# EAGLE design Schematic1 (EAGLE 9.5.1)
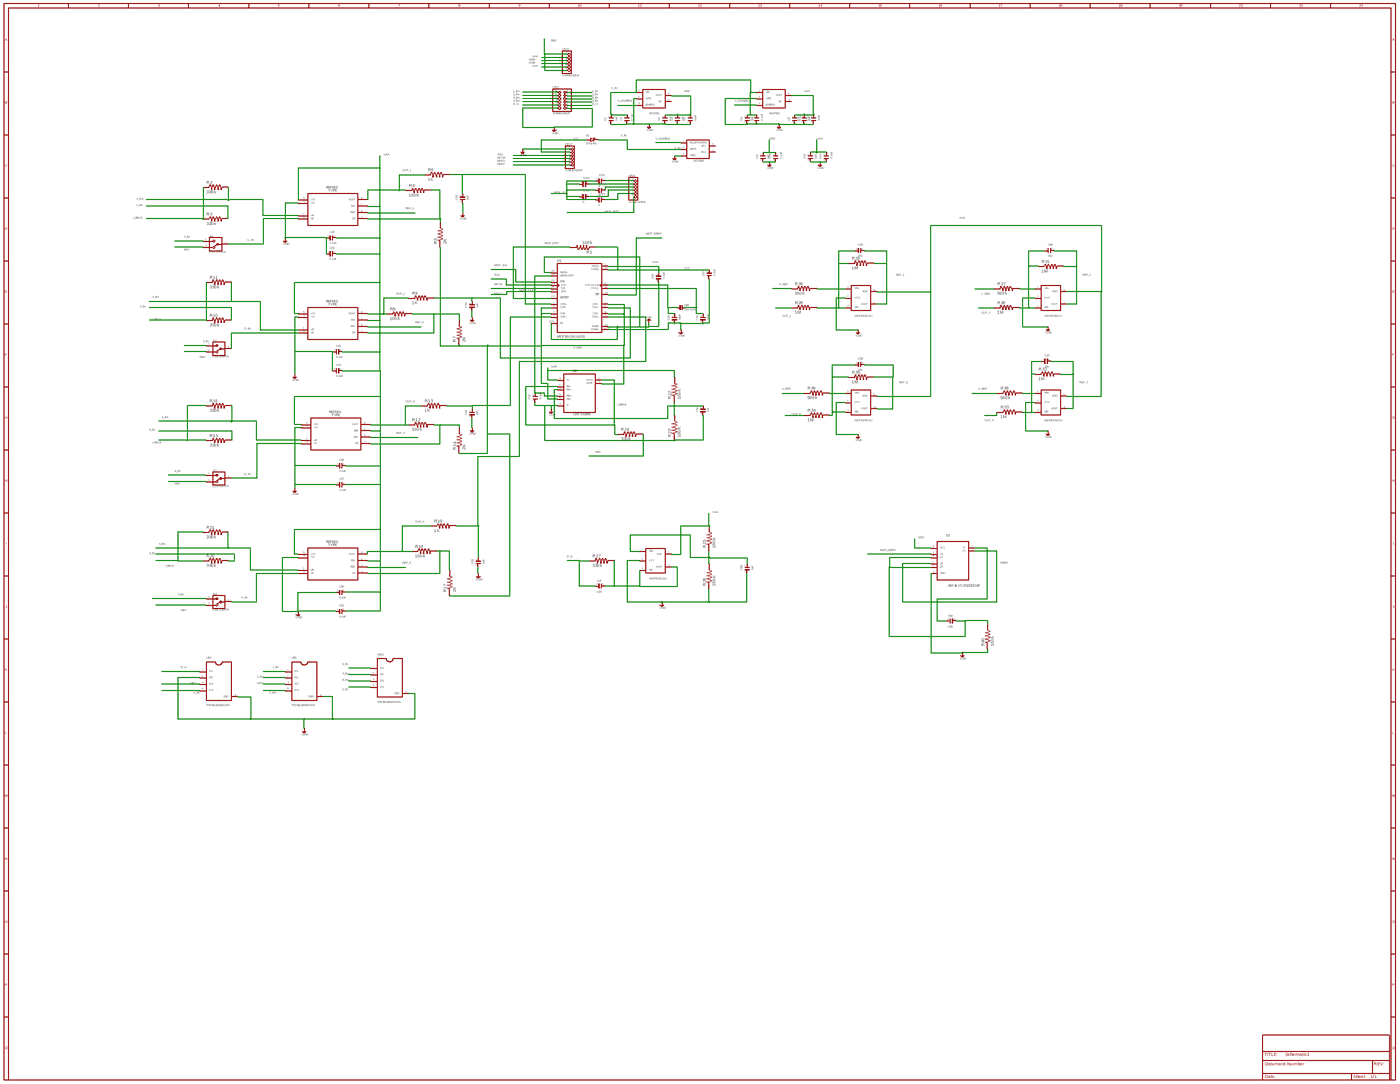
[diagram p0: schematic, sheet 1, overview]
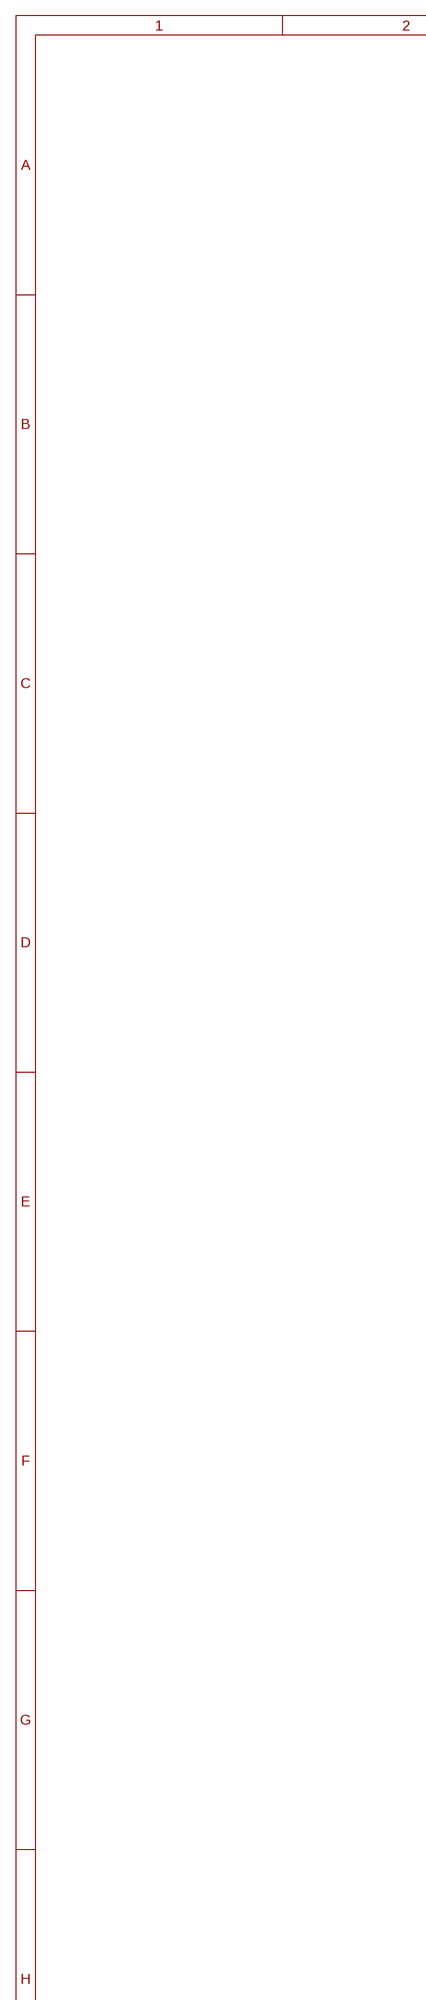
[diagram p1: schematic, sheet 1, part 1 of 8]
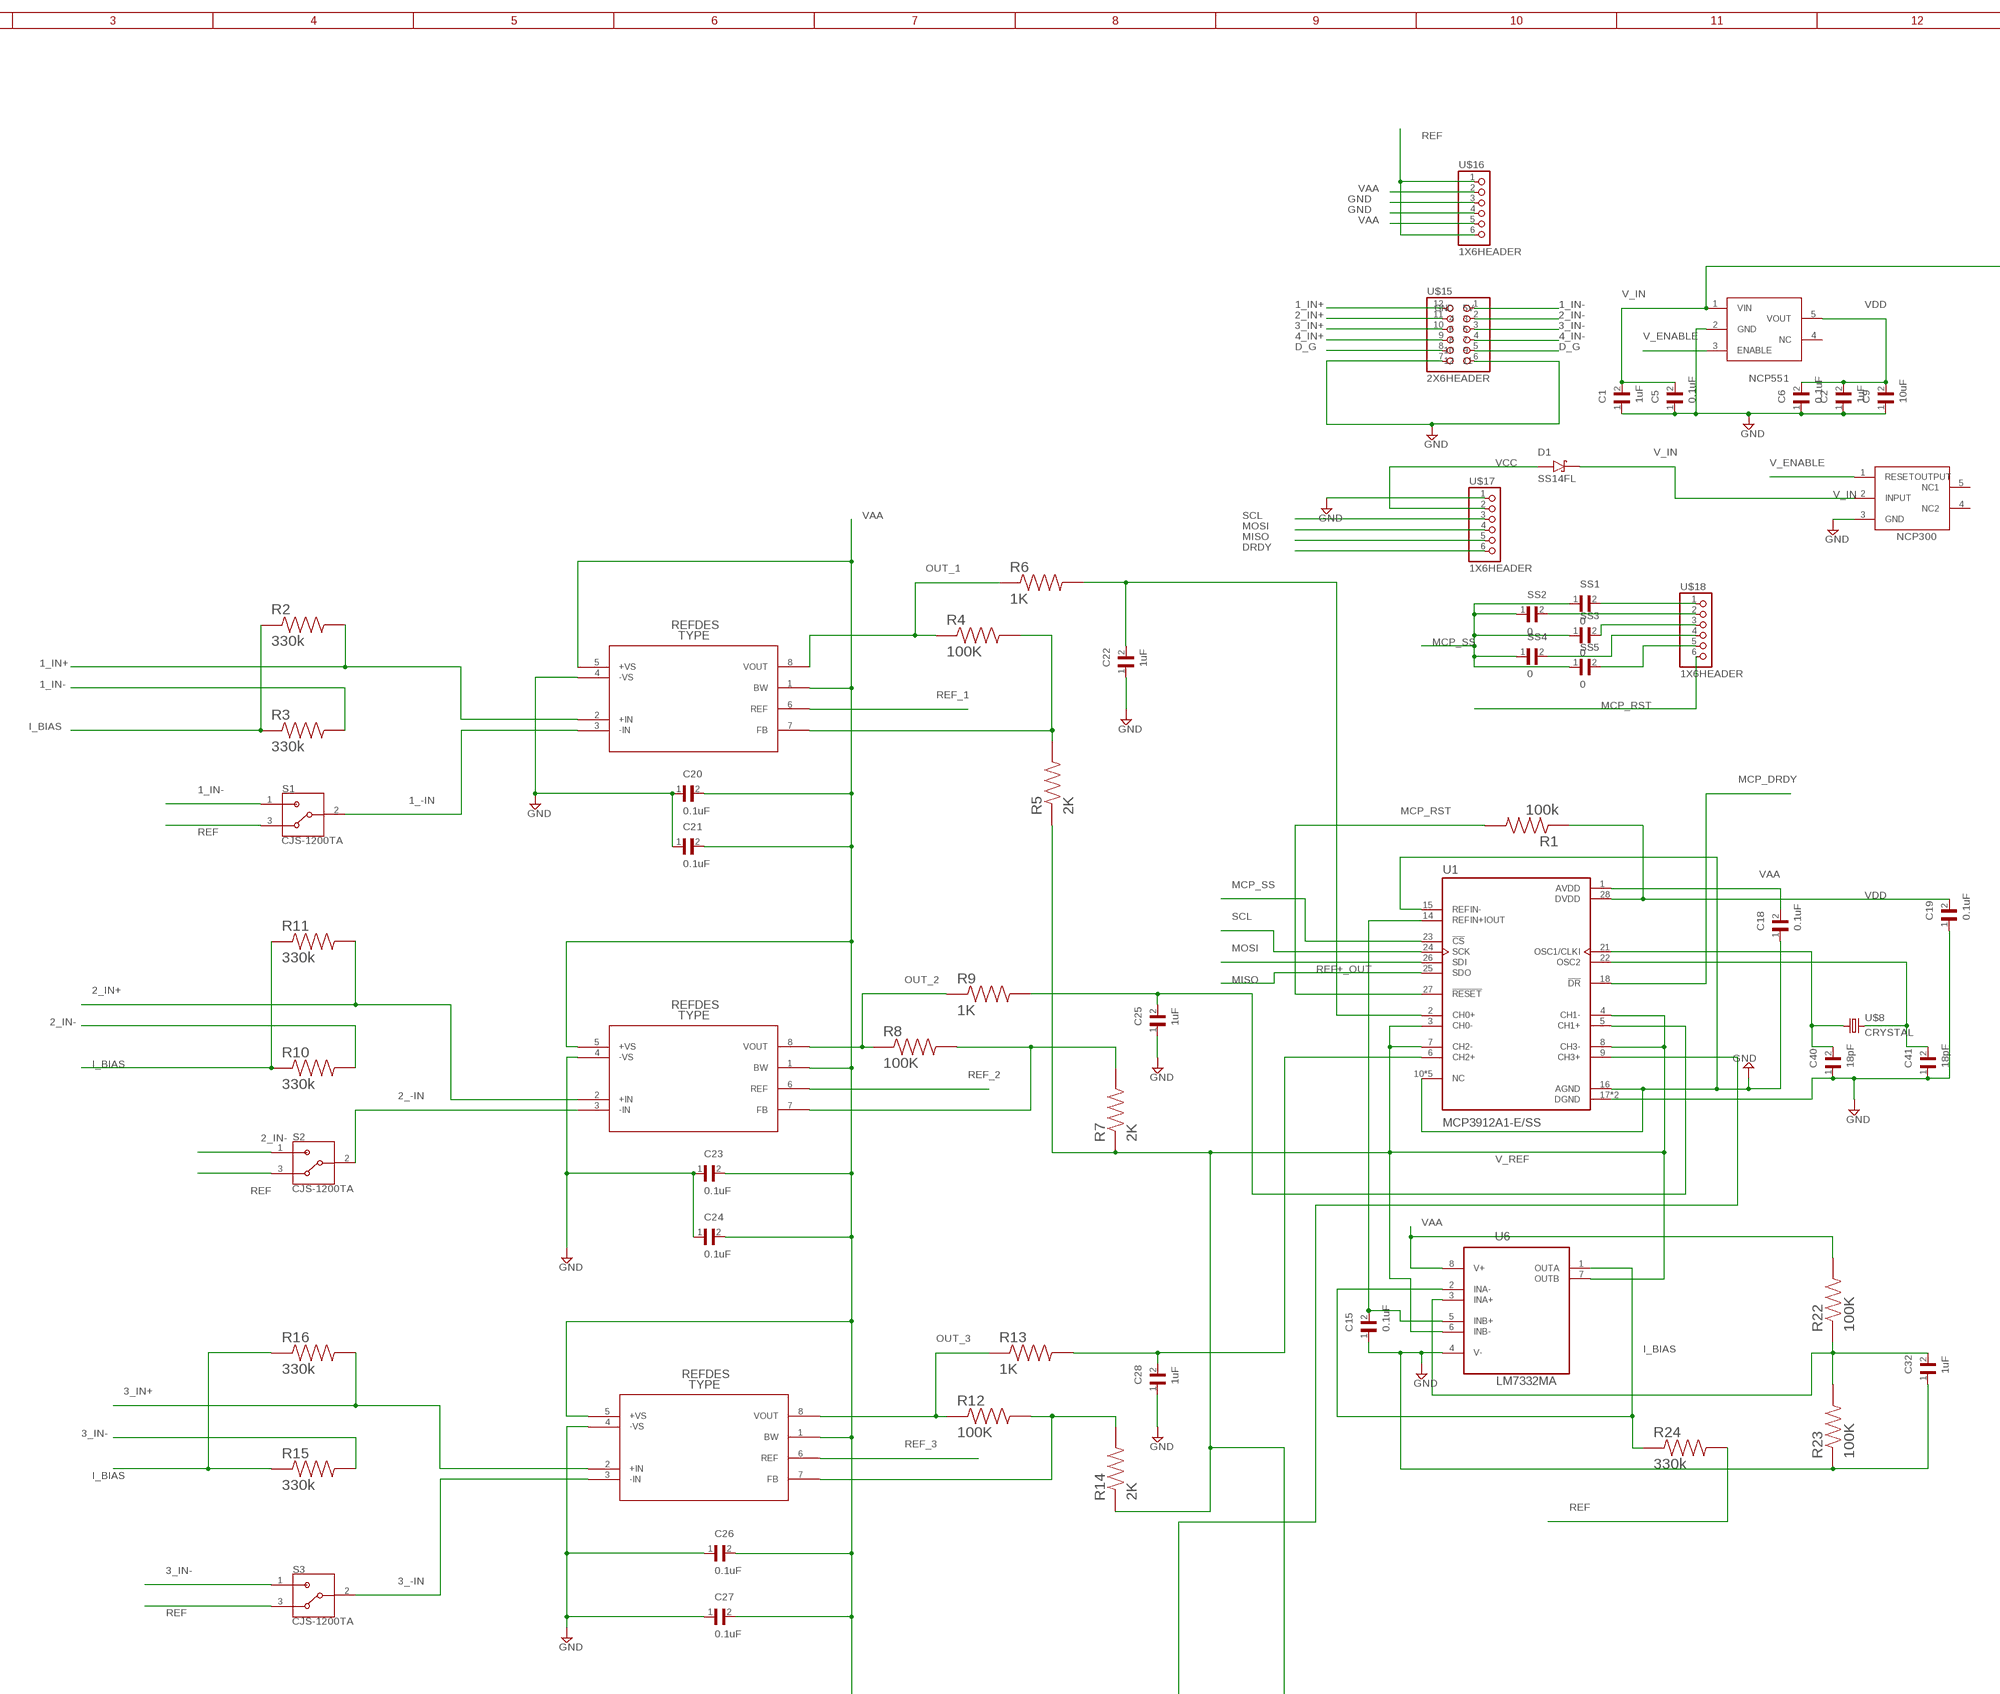
[diagram p2: schematic, sheet 1, part 2 of 8]
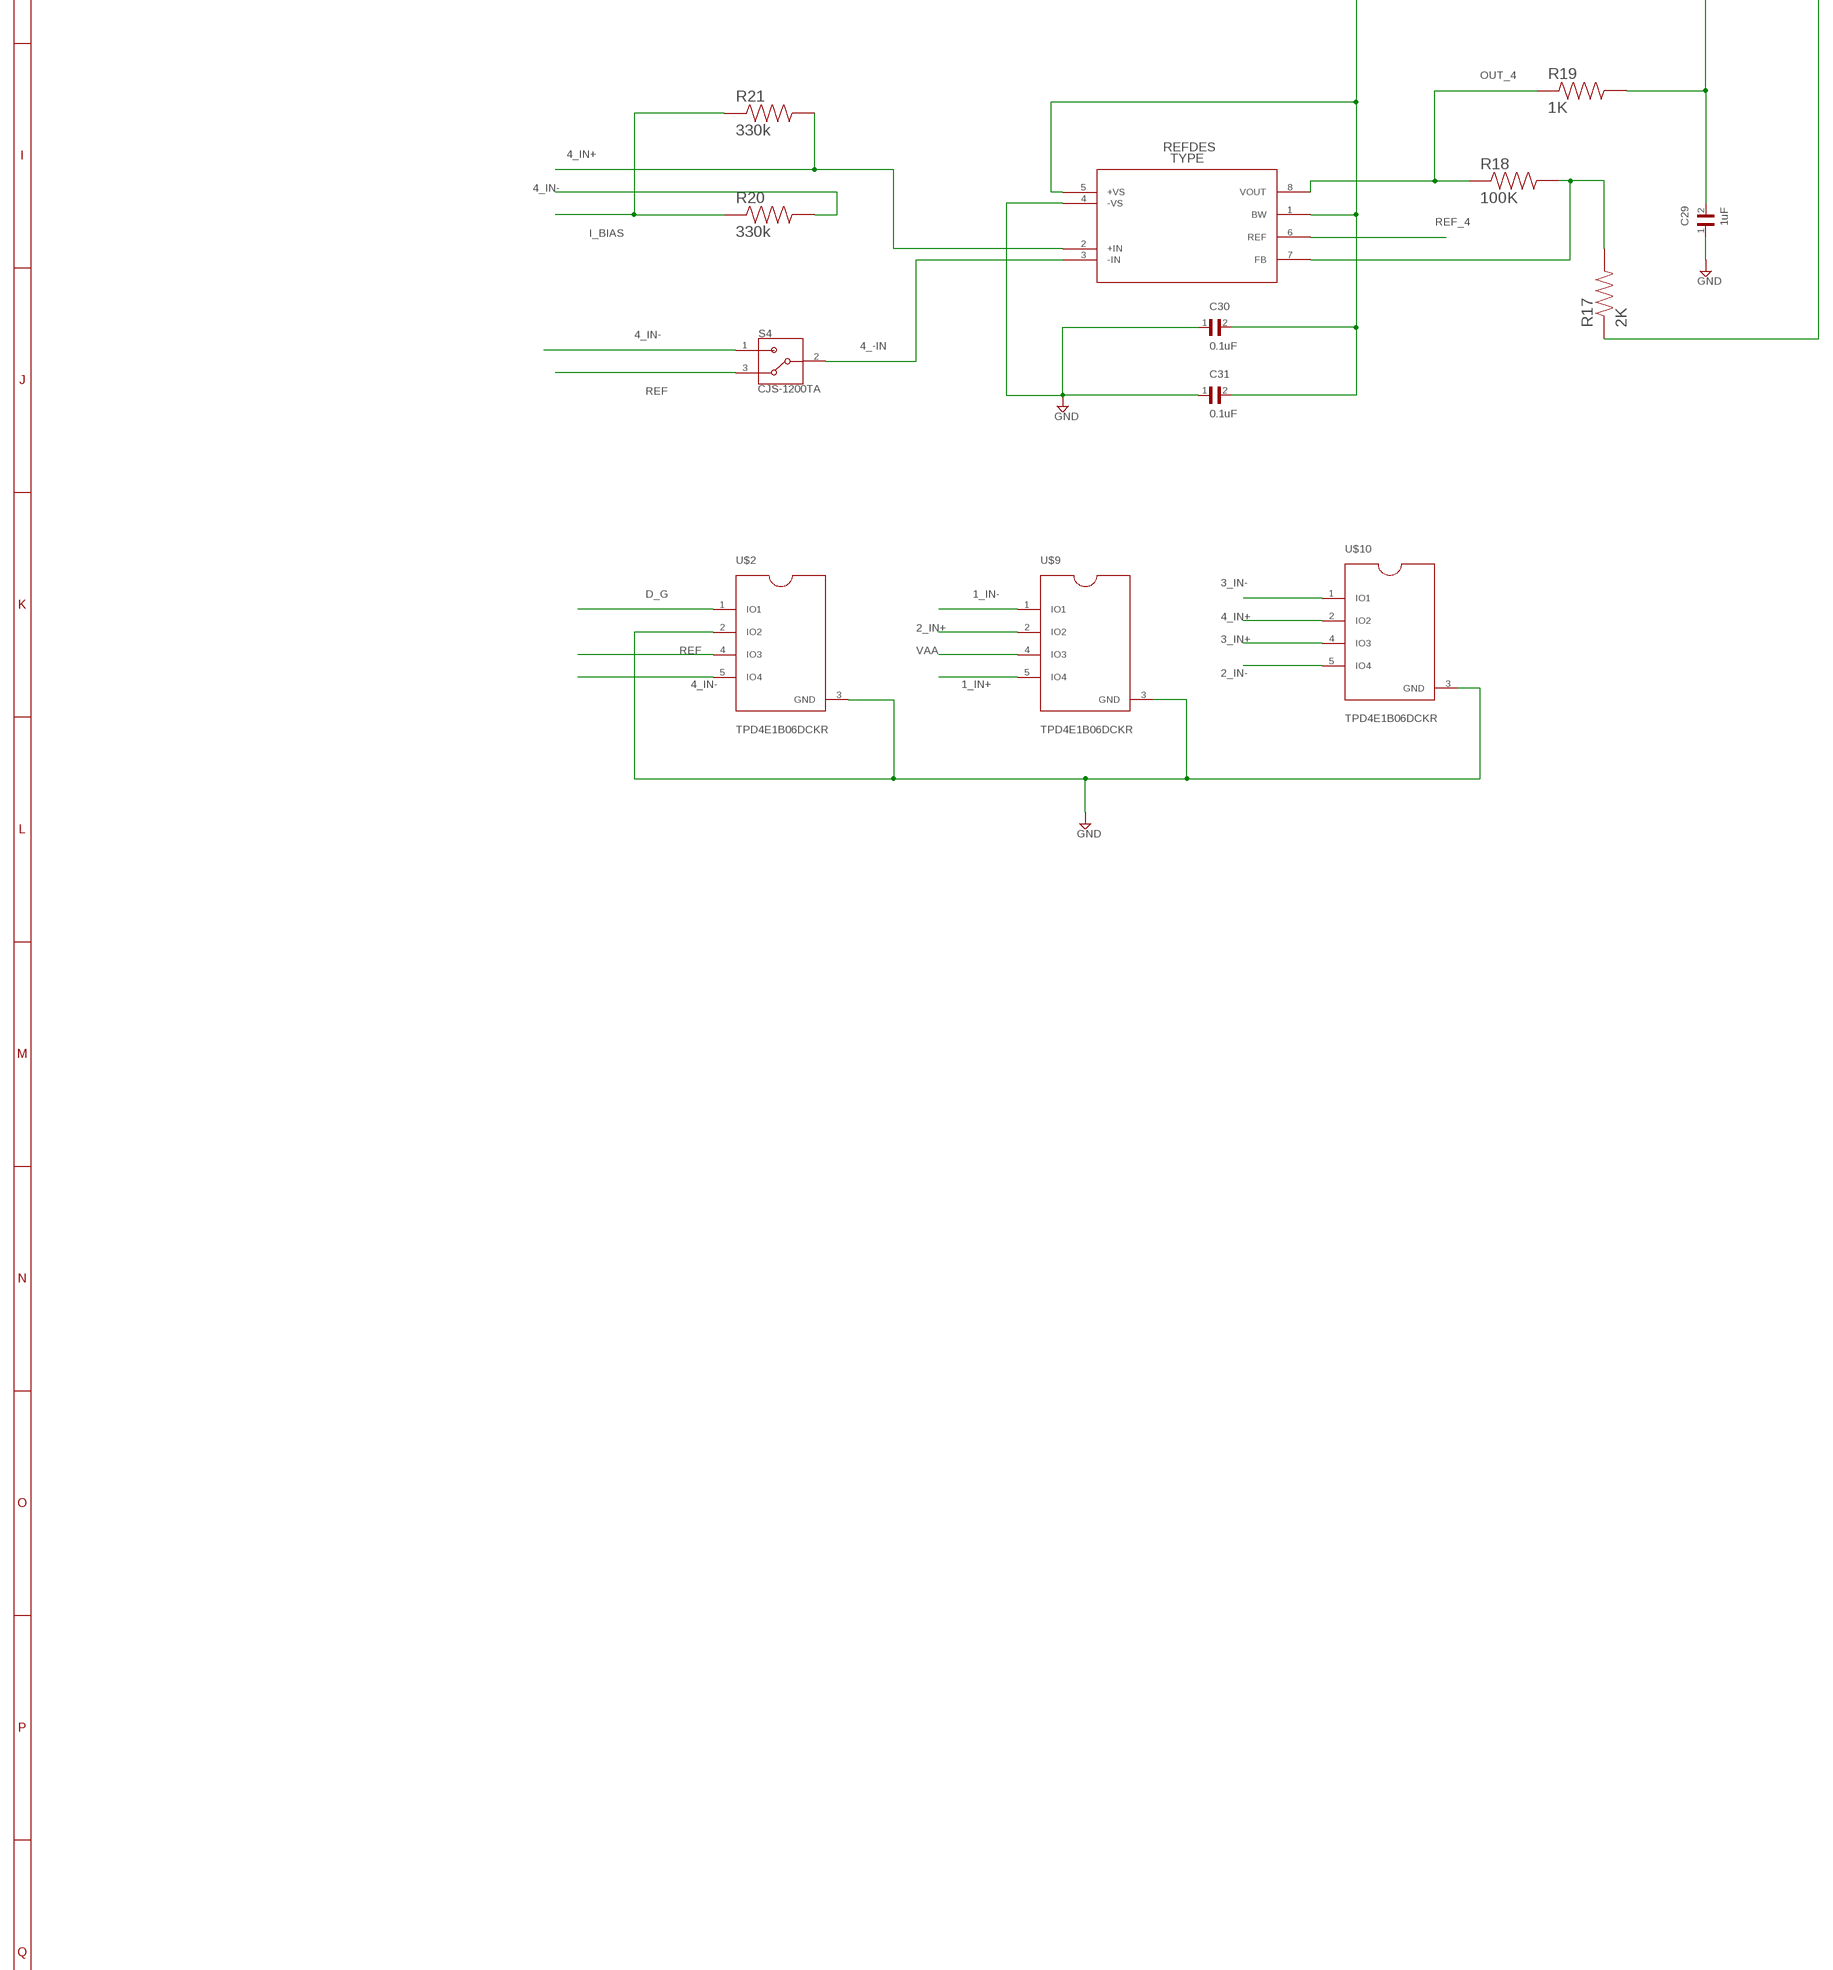
[diagram p3: schematic, sheet 1, part 3 of 8]
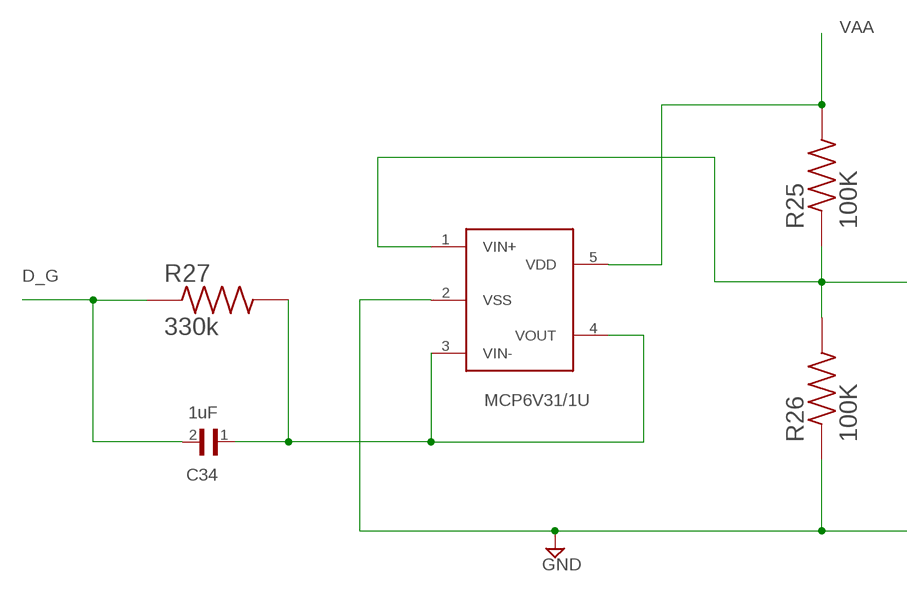
[diagram p4: schematic, sheet 1, part 4 of 8]
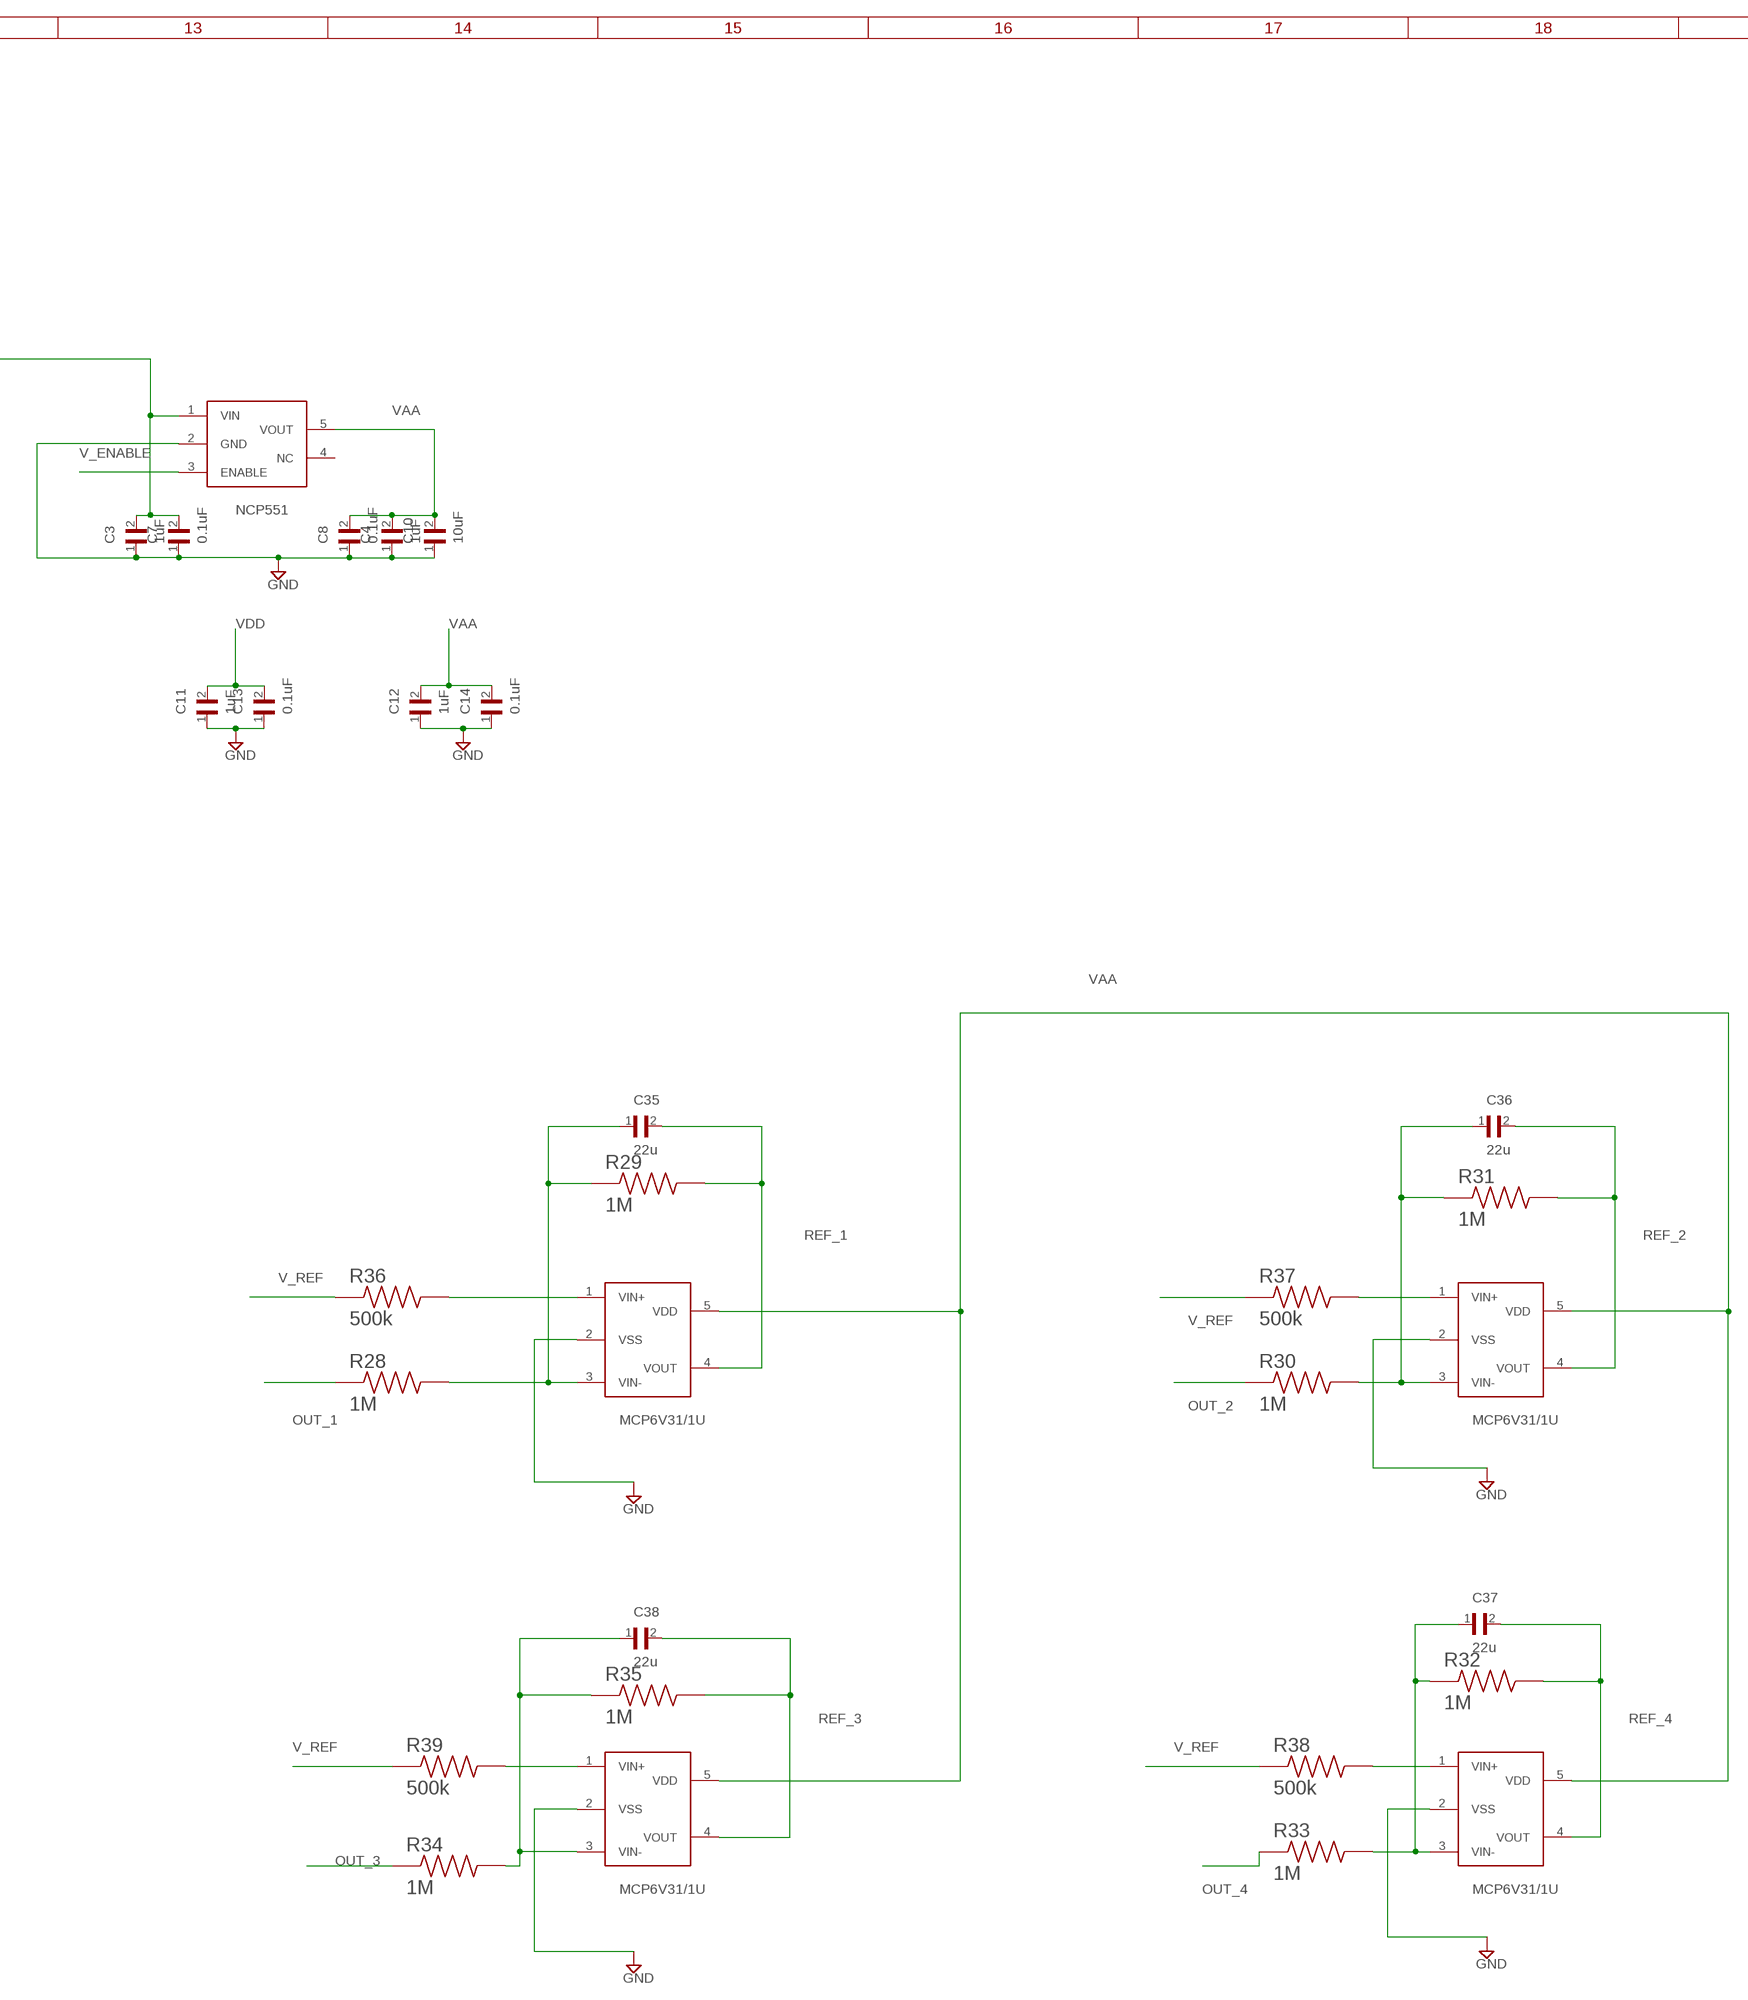
[diagram p5: schematic, sheet 1, part 5 of 8]
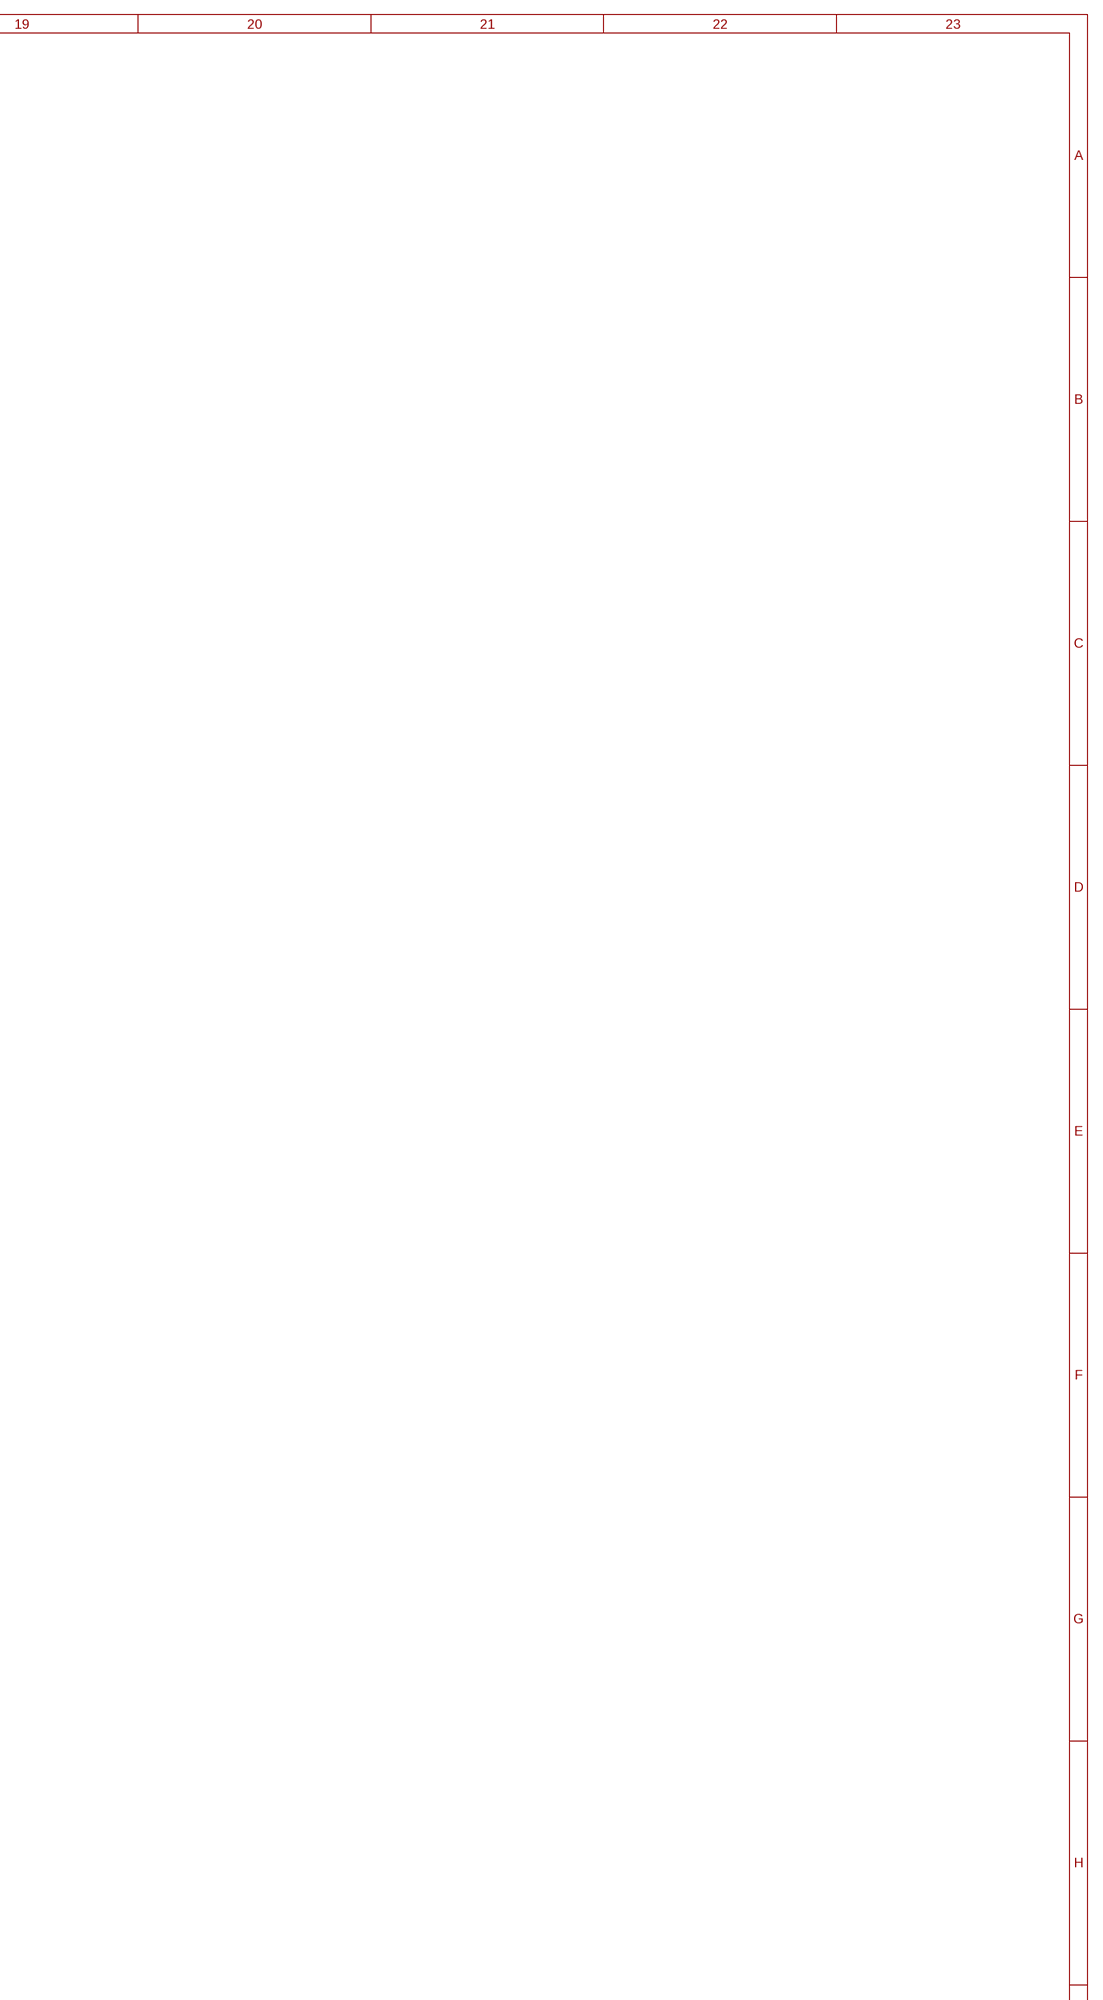
[diagram p6: schematic, sheet 1, part 6 of 8]
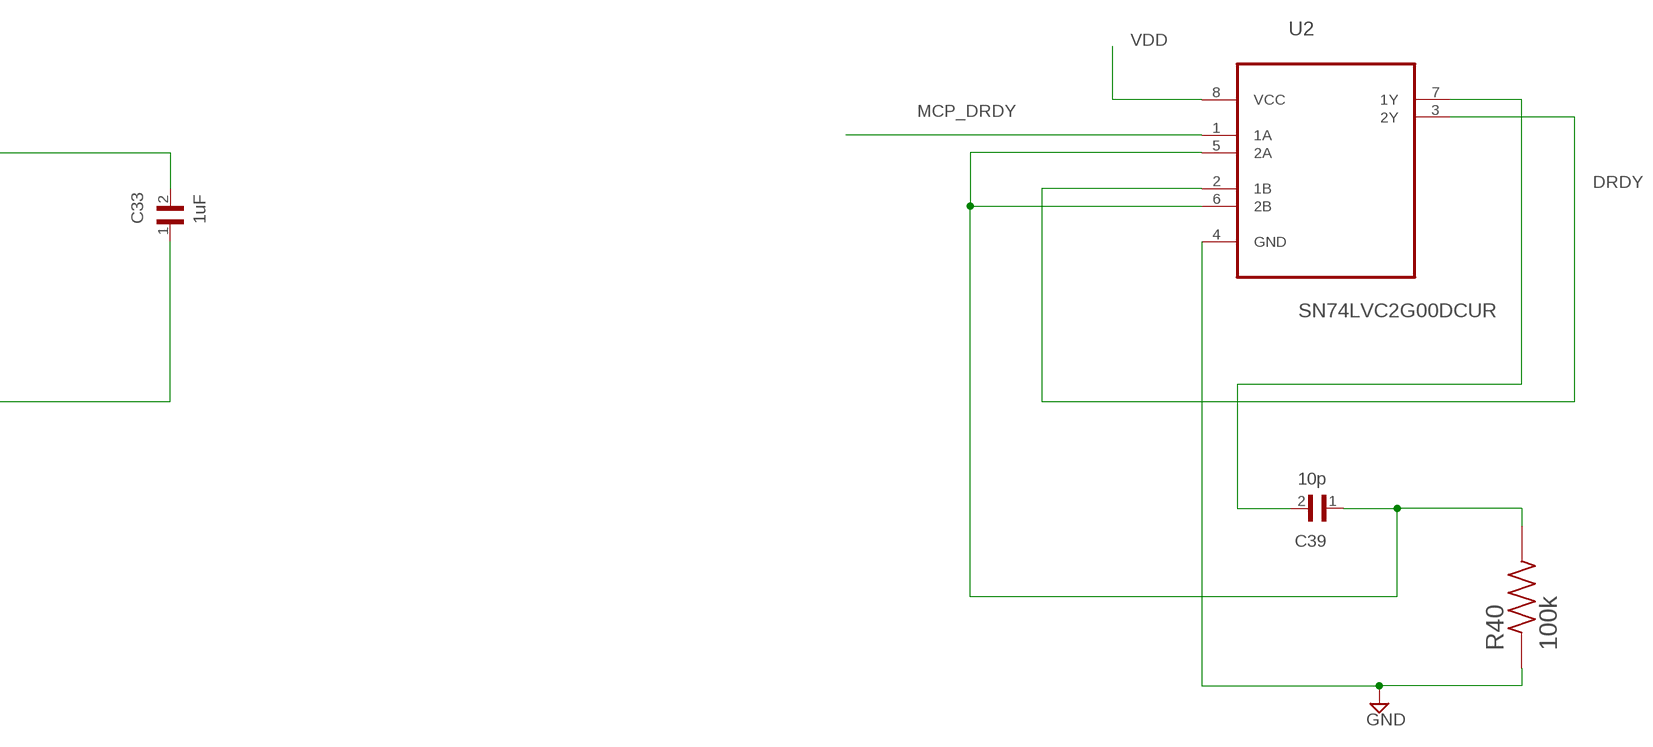
[diagram p7: schematic, sheet 1, part 7 of 8]
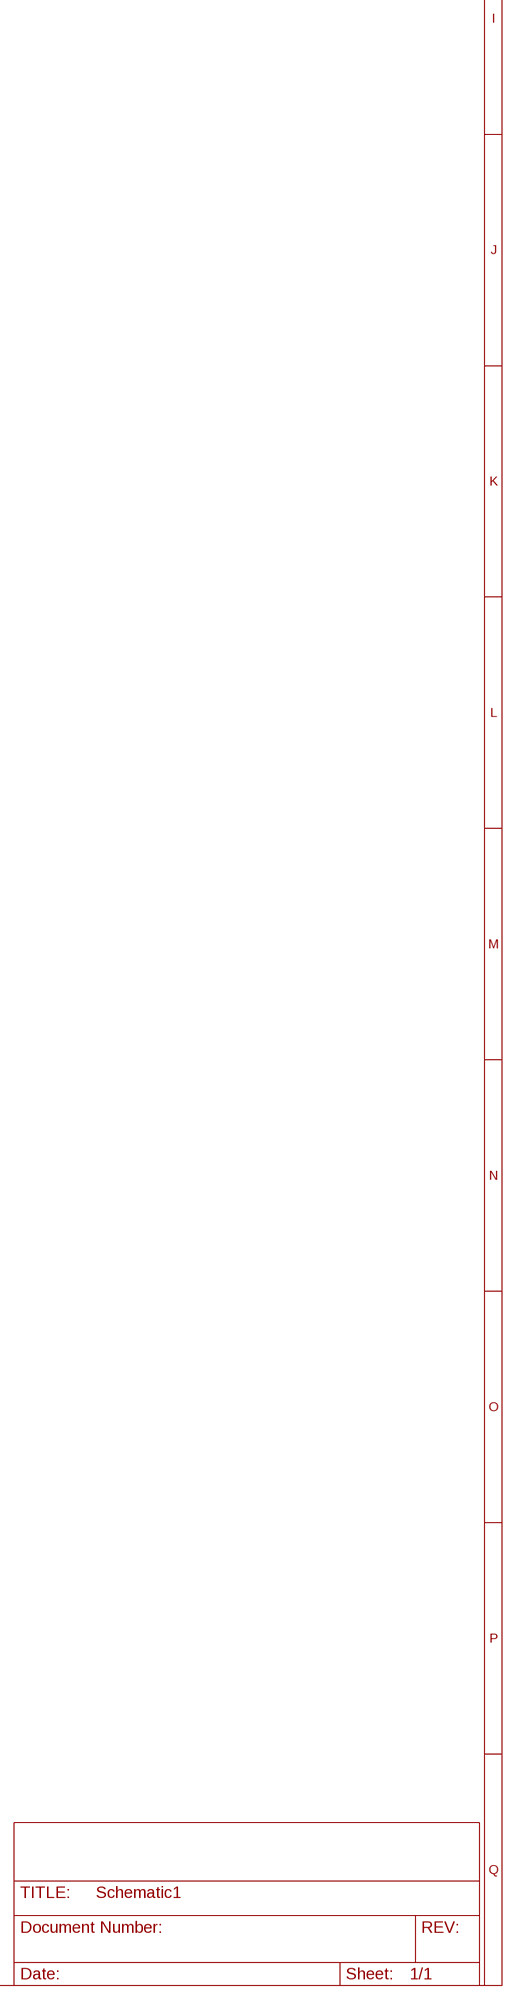
[diagram p8: schematic, sheet 1, part 8 of 8]

## Parts
AD1  AD8237ARMZ  [RM_8]
AD2  AD8237ARMZ  [RM_8]
AD3  AD8237ARMZ  [RM_8]
AD8237  AD8237ARMZ  [RM_8]
C1  1uF  EMF316B7105KLHT  [CAPC3216X180N]
C2  1uF  EMF316B7105KLHT  [CAPC3216X180N]
C3  1uF  EMF316B7105KLHT  [CAPC3216X180N]
C4  1uF  EMF316B7105KLHT  [CAPC3216X180N]
C5  0.1uF  TMF316B7104KLHT  [CAPC3216X180N]
C6  0.1uF  TMF316B7104KLHT  [CAPC3216X180N]
C7  0.1uF  TMF316B7104KLHT  [CAPC3216X180N]
C8  0.1uF  TMF316B7104KLHT  [CAPC3216X180N]
C9  10uF  LMF316AB7106KLHT  [CAPC3216X180N]
C10  10uF  LMF316AB7106KLHT  [CAPC3216X180N]
C11  1uF  EMF316B7105KLHT  [CAPC3216X180N]
C12  1uF  EMF316B7105KLHT  [CAPC3216X180N]
C13  0.1uF  TMF316B7104KLHT  [CAPC3216X180N]
C14  0.1uF  TMF316B7104KLHT  [CAPC3216X180N]
C15  0.1uF  TMF316B7104KLHT  [CAPC3216X180N]
C18  0.1uF  TMF316B7104KLHT  [CAPC3216X180N]
C19  0.1uF  TMF316B7104KLHT  [CAPC3216X180N]
C20  0.1uF  TMF316B7104KLHT  [CAPC3216X180N]
C21  0.1uF  TMF316B7104KLHT  [CAPC3216X180N]
C22  1uF  EMF316B7105KLHT  [CAPC3216X180N]
C23  0.1uF  TMF316B7104KLHT  [CAPC3216X180N]
C24  0.1uF  TMF316B7104KLHT  [CAPC3216X180N]
C25  1uF  EMF316B7105KLHT  [CAPC3216X180N]
C26  0.1uF  TMF316B7104KLHT  [CAPC3216X180N]
C27  0.1uF  TMF316B7104KLHT  [CAPC3216X180N]
C28  1uF  EMF316B7105KLHT  [CAPC3216X180N]
C29  1uF  EMF316B7105KLHT  [CAPC3216X180N]
C30  0.1uF  TMF316B7104KLHT  [CAPC3216X180N]
C31  0.1uF  TMF316B7104KLHT  [CAPC3216X180N]
C32  1uF  EMF316B7105KLHT  [CAPC3216X180N]
C33  1uF  EMF316B7105KLHT  [CAPC3216X180N]
C34  1uF  EMF316B7105KLHT  [CAPC3216X180N]
C35  22u  GRM188R60J226MEA0D  [CAPC1608X100N]
C36  22u  GRM188R60J226MEA0D  [CAPC1608X100N]
C37  22u  GRM188R60J226MEA0D  [CAPC1608X100N]
C38  22u  GRM188R60J226MEA0D  [CAPC1608X100N]
C39  10p  GCM188R71H103KA37D  [CAPC1608X90N]
C40  18pF  GRM188R60J226MEA0D  [CAPC1608X100N]
C41  18pF  GRM188R60J226MEA0D  [CAPC1608X100N]
D1  SS14FL  [SODFL3617X108N]
R1  100k  ERJ-3EKF1003V  [RESC1608X55N]
R2  330k  ERJ-3EKF3303V  [RESC1608X55N]
R3  330k  ERJ-3EKF3303V  [RESC1608X55N]
R4  100K  ERJ-3EKF1003V  [RESC1608X55N]
R5  2K  ERJ-3EKF2001V  [RESC1608X55N]
R6  1K  ERJ-3EKF1003V  [RESC1608X55N]
R7  2K  ERJ-3EKF2001V  [RESC1608X55N]
R8  100K  ERJ-3EKF1003V  [RESC1608X55N]
R9  1K  ERJ-3EKF1003V  [RESC1608X55N]
R10  330k  ERJ-3EKF3303V  [RESC1608X55N]
R11  330k  ERJ-3EKF3303V  [RESC1608X55N]
R12  100K  ERJ-3EKF1003V  [RESC1608X55N]
R13  1K  ERJ-3EKF1003V  [RESC1608X55N]
R14  2K  ERJ-3EKF2001V  [RESC1608X55N]
R15  330k  ERJ-3EKF3303V  [RESC1608X55N]
R16  330k  ERJ-3EKF3303V  [RESC1608X55N]
R17  2K  ERJ-3EKF2001V  [RESC1608X55N]
R18  100K  ERJ-3EKF1003V  [RESC1608X55N]
R19  1K  ERJ-3EKF1003V  [RESC1608X55N]
R20  330k  ERJ-3EKF3303V  [RESC1608X55N]
R21  330k  ERJ-3EKF3303V  [RESC1608X55N]
R22  100K  ERJ-3EKF1003V  [RESC1608X55N]
R23  100K  ERJ-3EKF1003V  [RESC1608X55N]
R24  330k  ERJ-3EKF3303V  [RESC1608X55N]
R25  100K  ERJ-3EKF1003V  [RESC1608X55N]
R26  100K  ERJ-3EKF1003V  [RESC1608X55N]
R27  330k  ERJ-3EKF3303V  [RESC1608X55N]
R28  1M  ERJ-3EKF1004V  [RESC1608X55N]
R29  1M  ERJ-3EKF1004V  [RESC1608X55N]
R30  1M  ERJ-3EKF1004V  [RESC1608X55N]
R31  1M  ERJ-3EKF1004V  [RESC1608X55N]
R32  1M  ERJ-3EKF1004V  [RESC1608X55N]
R33  1M  ERJ-3EKF1004V  [RESC1608X55N]
R34  1M  ERJ-3EKF1004V  [RESC1608X55N]
R35  1M  ERJ-3EKF1004V  [RESC1608X55N]
R36  500k  CR0603-FX-4993ELF  [RESC1608X55N]
R37  500k  CR0603-FX-4993ELF  [RESC1608X55N]
R38  500k  CR0603-FX-4993ELF  [RESC1608X55N]
R39  500k  CR0603-FX-4993ELF  [RESC1608X55N]
R40  100k  ERJ-3EKF1003V  [RESC1608X55N]
S1  CJS-1200TA  [SW_CJS-1200TA]
S2  CJS-1200TA  [SW_CJS-1200TA]
S3  CJS-1200TA  [SW_CJS-1200TA]
S4  CJS-1200TA  [SW_CJS-1200TA]
SS1  0  CBR02C180J9GAC  [CAPC0603X33N]
SS2  0  CBR02C180J9GAC  [CAPC0603X33N]
SS3  0  CBR02C180J9GAC  [CAPC0603X33N]
SS4  0  CBR02C180J9GAC  [CAPC0603X33N]
SS5  0  CBR02C180J9GAC  [CAPC0603X33N]
U1  MCP3912A1-E/SS  [SOP65P780X200-28N]
U2  SN74LVC2G00DCUR  [SOP50P310X90-8N]
U6  LM7332MA  [SOIC127P600X175-8N]
U$1  NCP551  [TSOP-5]
U$2  TPD4E1B06DCKR  [SC70-6]
U$3  MCP6V31/1U  [SOT23-5]
U$4  NCP551  [TSOP-5]
U$5  NCP300  [SOT23-5]
U$8  CRYSTAL  [CRYSTAL]
U$9  TPD4E1B06DCKR  [SC70-6]
U$10  TPD4E1B06DCKR  [SC70-6]
U$11  MCP6V31/1U  [SOT23-5]
U$12  MCP6V31/1U  [SOT23-5]
U$13  MCP6V31/1U  [SOT23-5]
U$14  MCP6V31/1U  [SOT23-5]
U$15  2X6HEADER  [PINHEADER2X6]
U$16  1X6HEADER  [PINHEADER1X6]
U$17  1X6HEADER  [PINHEADER1X6]
U$18  1X6HEADER  [PINHEADER1X6]

## Nets
1_-IN: AD8237.3(-IN) S1.2
1_IN+: AD8237.2(+IN) R2.2 U$9.5(IO4) U$15.12(5V)
1_IN-: R3.2 S1.1 U$9.1(IO1) U$15.1(GND)
2_-IN: AD1.3(-IN) S2.2
2_IN+: AD1.2(+IN) R11.2 U$9.2(IO2) U$15.11
2_IN-: R10.2 S2.1 U$10.5(IO4) U$15.2
3_-IN: AD2.3(-IN) S3.2
3_IN+: AD2.2(+IN) R16.2 U$10.4(IO3) U$15.10
3_IN-: R15.2 S3.1 U$10.1(IO1) U$15.3
4_-IN: AD3.3(-IN) S4.2
4_IN+: AD3.2(+IN) R21.2 U$10.2(IO2) U$15.9
4_IN-: R20.2 S4.1 U$2.5(IO4) U$15.4
D_G: C34.2 R27.1 U$2.1(IO1) U$15.5 U$15.8
DRDY: U2.2(1B) U2.3(2Y) U$17.6
GND: AD1.4(-VS) AD2.4(-VS) AD3.4(-VS) AD8237.4(-VS) C1.1 C2.1 C3.1 C4.1 C5.1 C6.1 C7.1 C8.1 C9.1 C10.1 C11.1 C12.1 C13.1 C14.1 C15.1 C18.1 C19.1 C20.1 C21.1 C22.1 C23.1 C24.1 C25.1 C26.1 C27.1 C28.1 C29.1 C30.1 C31.1 C32.1 C33.1 C40.1 C41.1 R23.1 R26.1 R40.1 U1.10(NC) U1.11(NC) U1.12(NC) U1.13(NC) U1.15(REFIN-) U1.16(AGND) U1.17(DGND) U1.19(NC) U1.20(DGND) U2.4(GND) U6.4(V-) U$1.2(GND) U$2.2(IO2) U$2.3(GND) U$3.2(VSS) U$4.2(GND) U$5.3(GND) U$9.3(GND) U$10.3(GND) U$11.2(VSS) U$12.2(VSS) U$13.2(VSS) U$14.2(VSS) U$15.6 U$15.7 U$16.3 U$16.4 U$17.1
I_BIAS: R2.1 R3.1 R10.1 R11.1 R15.1 R16.1 R20.1 R21.1 R24.1 U6.1(OUTA) U6.2(INA-)
MCP_DRDY: U1.18(!DR) U2.1(1A)
MCP_RST: R1.2 U1.27(!RESET) U$18.6
MCP_SS: SS1.1 SS2.1 SS3.1 SS4.1 SS5.1 U1.23(!CS)
MISO: U1.25(SDO) U$17.5
MOSI: U1.26(SDI) U$17.4
N$1: C41.2 U1.22(OSC2) U$8.2
N$3: C40.2 U1.21(OSC1/CLKI) U$8.1
N$4: SS2.2 U$18.2
N$5: C29.2 R19.2 U1.9(CH3+)
N$6: AD8237.7(FB) R4.2 R5.2
N$7: AD2.7(FB) R12.2 R14.2
N$8: C22.2 R6.2 U1.2(CH0+)
N$9: AD1.7(FB) R7.2 R8.2
N$10: C25.2 R9.2 U1.5(CH1+)
N$11: C28.2 R13.2 U1.6(CH2+)
N$12: AD3.7(FB) R17.2 R18.2
N$13: C32.2 R22.1 R23.2 U6.3(INA+)
N$14: C33.2 R25.1 R26.2 U$3.1(VIN+)
N$15: C34.1 R27.2 U$3.3(VIN-) U$3.4(VOUT)
N$16: C38.1 R34.2 R35.1 U$13.3(VIN-)
N$17: SS1.2 U$18.1
N$18: C37.1 R32.1 R33.2 U$14.3(VIN-)
N$19: SS3.2 U$18.3
N$20: R36.2 U$11.1(VIN+)
N$21: C39.1 R40.2 U2.5(2A) U2.6(2B)
N$22: C39.2 U2.7(1Y)
N$23: R39.2 U$13.1(VIN+)
N$24: SS4.2 U$18.4
N$25: R38.2 U$14.1(VIN+)
N$26: C36.1 R30.2 R31.1 U$12.3(VIN-)
N$27: R37.2 U$12.1(VIN+)
N$28: SS5.2 U$18.5
N$31: C35.1 R28.2 R29.1 U$11.3(VIN-)
OUT_1: AD8237.8(VOUT) R4.1 R6.1 R28.1
OUT_2: AD1.8(VOUT) R8.1 R9.1 R30.1
OUT_3: AD2.8(VOUT) R12.1 R13.1 R34.1
OUT_4: AD3.8(VOUT) R18.1 R19.1 R33.1
REF: R24.2 S1.3 S2.3 S3.3 S4.3 U$2.4(IO3) U$16.1 U$16.6
REF+_OUT: C15.2 U1.14(REFIN+IOUT) U6.5(INB+)
REF_1: AD8237.6(REF) C35.2 R29.2 U$11.4(VOUT)
REF_2: AD1.6(REF) C36.2 R31.2 U$12.4(VOUT)
REF_3: AD2.6(REF) C38.2 R35.2 U$13.4(VOUT)
REF_4: AD3.6(REF) C37.2 R32.2 U$14.4(VOUT)
SCL: U1.24(SCK) U$17.3
V_ENABLE: U$1.3(ENABLE) U$4.3(ENABLE) U$5.1(RESETOUTPUT)
V_IN: C1.2 C3.2 C5.2 C7.2 D1.C(K) U$1.1(VIN) U$4.1(VIN) U$5.2(INPUT)
V_REF: R5.1 R7.1 R14.1 R17.1 R36.1 R37.1 R38.1 R39.1 U1.3(CH0-) U1.4(CH1-) U1.7(CH2-) U1.8(CH3-) U6.6(INB-) U6.7(OUTB)
VAA: AD1.1(BW) AD1.5(+VS) AD2.1(BW) AD2.5(+VS) AD3.1(BW) AD3.5(+VS) AD8237.1(BW) AD8237.5(+VS) C4.2 C8.2 C10.2 C12.2 C14.2 C18.2 C20.2 C21.2 C23.2 C24.2 C26.2 C27.2 C30.2 C31.2 R22.2 R25.2 U1.1(AVDD) U6.8(V+) U$3.5(VDD) U$4.5(VOUT) U$9.4(IO3) U$11.5(VDD) U$12.5(VDD) U$13.5(VDD) U$14.5(VDD) U$16.2 U$16.5
VCC: D1.A U$17.2
VDD: C2.2 C6.2 C9.2 C11.2 C13.2 C19.2 R1.1 U1.28(DVDD) U2.8(VCC) U$1.5(VOUT)
Unconnected: U$1.4(NC) U$4.4(NC) U$5.4(NC2) U$5.5(NC1)

## Library data of the parts
AD1-AD3 AD8237 = AD8237ARMZ:AD8237ARMZ; AVAILABILITY: Unavailable; DESCRIPTION: SP Amp INSTR Amp Single R-R I/O 5.5V 8-Pin MSOP Tube; MF: Analog Devices; MP: AD8237ARMZ; PACKAGE: MSOP-8 Analog Devices; PRICE: None
C1 = EMF316B7105KLHT:EMF316B7105KLHT; AVAILABILITY: Unavailable; DESCRIPTION: CAP, MLCC, 1206/3216, 16V, X7R,; MF: Taiyo Yuden; MP: 1uF; PACKAGE: 3216 Taiyo Yuden; PRICE: None
C2-C4 C11 C12 C22 C25 C28 C29 C32-C34 = EMF316B7105KLHT:EMF316B7105KLHT; AVAILABILITY: Unavailable; DESCRIPTION: CAP, MLCC, 1206/3216, 16V, X7R,; MF: Taiyo Yuden; MP: EMF316B7105KLHT; PACKAGE: 3216 Taiyo Yuden; PRICE: None
C5-C8 C13-C15 C18-C21 C23 C24 C26 C27 C30 C31 = TMF316B7104KLHT:TMF316B7104KLHT; DESCRIPTION: CAP, MLCC, 1206/3216, 25V, X7R,; DIGI-KEY_PART_NUMBER: 587-6507-1-ND; DIGI-KEY_PURCHASE_URL: https://www.digikey.in/product-detail/en/taiyo-yuden/TMF316B7104KLHT/587-6507-1-ND/10379200?utm_source=snapeda&utm_medium=aggregator&utm_campaign=symbol; MF: Taiyo Yuden; MP: TMF316B7104KLHT; PACKAGE: 3216 Taiyo Yuden
C9 C10 = LMF316AB7106KLHT:LMF316AB7106KLHT; DESCRIPTION: CAP, MLCC, 1206/3216, 10V, X7R,; DIGI-KEY_PART_NUMBER: 587-6493-1-ND; DIGI-KEY_PURCHASE_URL: https://www.digikey.in/product-detail/en/taiyo-yuden/LMF316AB7106KLHT/587-6493-1-ND/10379186?utm_source=snapeda&utm_medium=aggregator&utm_campaign=symbol; MF: Taiyo Yuden; MP: LMF316AB7106KLHT; PACKAGE: 3216 Taiyo Yuden
C35-C38 C40 C41 = GRM188R60J226MEA0D:GRM188R60J226MEA0D: Cap Ceramic 22uF 6.3V X5R 20% Pad SMD 0603 85°C T/R; AVAILABILITY: Unavailable; DESCRIPTION: Cap Ceramic 22uF 6.3V X5R 20% Pad SMD 0603 85°C T/R; MF: Murata; MP: GRM188R60J226MEA0D; PACKAGE: 1608 Murata; PRICE: None
C39 = GCM188R71H103KA37D:GCM188R71H103KA37D: 0603 10 nF 50V ±10% Tolerance X7R SMT Multilayer Ceramic Capacitor; DESCRIPTION: Multilayer Ceramic Capacitor, AEC-Q200 GCM Series, 0.01 F, 10%, X7R, 50 V; DIGI-KEY_PART_NUMBER: 490-4778-1-ND; DIGI-KEY_PURCHASE_URL: https://www.digikey.in/product-detail/en/murata-electronics/GCM188R71H103KA37D/490-4778-1-ND/1641697?utm_source=snapeda&utm_medium=aggregator&utm_campaign=symbol; MF: Murata Electronics; MP: GCM188R71H103KA37D; PACKAGE: 1608 Murata
D1 = SS14FL:SS14FL: Diode Schottky 40v 1a Sod123f; AVAILABILITY: Unavailable; DESCRIPTION: Diode Schottky 40V 1A Surface Mount SOD-123F; MF: ON Semiconductor; MP: SS14FL; PACKAGE: SOD-123F ON Semiconductor; PRICE: None
R1 R4 R6 R8 R9 R12 R13 R18 R19 R22 R23 R25 R26 R40 = ERJ-3EKF1003V:ERJ-3EKF1003V: RES SMD 100K OHM 1% 1/10W 0603; AVAILABILITY: Unavailable; DESCRIPTION: Res Thick Film 0603 100K Ohm 1% 0.1W_1/10W_ ±100ppm/°C Molded SMD Automotive Punched T/R; MF: Panasonic; MP: ERJ-3EKF1003V; PACKAGE: 1608 Panasonic Electronic Components; PRICE: None
R2 R3 R10 R11 R15 R16 R20 R21 R24 R27 = ERJ-3EKF3303V:ERJ-3EKF3303V: Thick Film Chip Resistor 0.1W 0603 330K; DESCRIPTION: Res Thick Film 0603 330K Ohm 1% 0.1W_1/10W_ ±100ppm/C Molded SMD Automotive Punched T/R; DIGI-KEY_PART_NUMBER: P330KHCT-ND; DIGI-KEY_PURCHASE_URL: https://www.digikey.in/product-detail/en/panasonic-electronic-components/ERJ-3EKF3303V/P330KHCT-ND/1746764?utm_source=snapeda&utm_medium=aggregator&utm_campaign=symbol; MF: Panasonic; MP: ERJ-3EKF3303V; PACKAGE: 1608 Panasonic Electronic Components
R5 R7 R14 R17 = ERJ-3EKF2001V:ERJ-3EKF2001V: Res Thick Film 0603 2K Ohm 1% 1/10W ±100ppm/°C SMD Punched Carrier T/R; DESCRIPTION: Res Thick Film 0603 2K Ohm 1% 0.1W_1/10W_ ±100ppm/°C Molded SMD Automotive Punched T/R; DIGI-KEY_PART_NUMBER: P2.00KHCT-ND; DIGI-KEY_PURCHASE_URL: https://www.digikey.in/product-detail/en/panasonic-electronic-components/ERJ-3EKF2001V/P2.00KHCT-ND/198219?utm_source=snapeda&utm_medium=aggregator&utm_campaign=symbol; MF: Panasonic; MP: ERJ-3EKF2001V; PACKAGE: 1608 Panasonic Electronic Components
R28-R35 = ERJ-3EKF1004V:ERJ-3EKF1004V: Resistor; Thick Film; Res 1 Megohms; Pwr-Rtg 0.1 W; Tol 1%; SMT; 0603; Cut Tape; DESCRIPTION: Res Thick Film 0603 1M Ohm 1% 0.1W_1/10W_ ±100ppm/°C Molded SMD Automotive Punched T/R; DIGI-KEY_PART_NUMBER: P1.00MHCT-ND; DIGI-KEY_PURCHASE_URL: https://www.digikey.in/product-detail/en/panasonic-electronic-components/ERJ-3EKF1004V/P1.00MHCT-ND/198072?utm_source=snapeda&utm_medium=aggregator&utm_campaign=symbol; MF: Panasonic; MP: ERJ-3EKF1004V; PACKAGE: 1608 Panasonic Electronic Components
R36-R39 = CR0603-FX-4993ELF:CR0603-FX-4993ELF; DESCRIPTION: 499 kOhms ±1% 0.1W, 1/10W Chip Resistor 0603 _1608 Metric_ Moisture Resistant Thick Film; DIGI-KEY_PART_NUMBER: CR0603-FX-4993ELFCT-ND; DIGI-KEY_PURCHASE_URL: https://www.digikey.in/product-detail/en/bourns-inc/CR0603-FX-4993ELF/CR0603-FX-4993ELFCT-ND/4247808?utm_source=snapeda&utm_medium=aggregator&utm_campaign=symbol; MF: Bourns; MP: CR0603-FX-4993ELF; PACKAGE: 1608 Rohm Semiconductor
S1-S4 = CJS-1200TA:CJS-1200TA: Switch Slide N.O./N.C. SPDT Raised Slide 0.1A 24VDC J-Hook SMD Embossed T/R; AVAILABILITY: Unavailable; DESCRIPTION: Switch Slide N.O./N.C. SPDT Flush Slide 0.1A 24VDC J-Hook SMD T/R; MF: Nidec Copal; MP: CJS-1200TA; PACKAGE: None; PRICE: None
SS1-SS5 = CBR02C180J9GAC:CBR02C180J9GAC; AVAILABILITY: Unavailable; DESCRIPTION: CAP CER 18PF 6.3V NP0 0201; MF: KEMET; MP: CBR02C180J9GAC; PACKAGE: 0603 Taiyo Yuden; PRICE: None
U1 = MCP3912A1-E_SS:MCP3912A1-E/SS: None; AVAILABILITY: Unavailable; DESCRIPTION: AFE General Purpose 4ADC 24bit 3.3V Automotive Medical 28-Pin SSOP Tube; MF: Microchip; MP: MCP3912A1-E/SS; PACKAGE: SSOP-28 Microchip; PRICE: None
U2 = SN74LVC2G00DCUR:SN74LVC2G00DCUR: DUAL 2-INPUT POSITIVE-NAND GATE; AVAILABILITY: Unavailable; DESCRIPTION: Dual 2-Input Positive-NAND Gate 8-VSSOP -40 to 125; MF: Texas Instruments; MP: SN74LVC2G00DCUR; PACKAGE: VFSOP-8 Texas Instruments; PRICE: None
U6 = LM7332MA:LM7332MA: Operational Amplifier; AVAILABILITY: Unavailable; DESCRIPTION: Ic, Op Amp, Dual, r/r, 30v, 8soic; MF: Texas Instruments; MP: LM7332MA; PACKAGE: SOIC-8 Texas Instruments; PRICE: None
U$1 U$4 = Jigyans Library:NCP551
U$2 U$9 U$10 = TPD4E1B06DCKR:TPD4E1B06DCKR: Bidirectional Quad Channel High Speed ESD Protection Device 6-SC70 -40 to 125; DESCRIPTION: 14.5V _Typ_ Clamp 3A _8/20µs_ Ipp Tvs Diode Surface Mount SC-70-6; DIGI-KEY_PART_NUMBER: 296-39346-1-ND; DIGI-KEY_PURCHASE_URL: https://www.digikey.in/product-detail/en/texas-instruments/TPD4E1B06DCKR/296-39346-1-ND/5143298?utm_source=snapeda&utm_medium=aggregator&utm_campaign=symbol; MF: Texas Instruments; MP: TPD4E1B06DCKR; PACKAGE: SC-70 Texas Instruments
U$3 U$11-U$14 = Jigyans Library:MCP6V31/1U
U$5 = Jigyans Library:NCP300
U$8 = Jigyans Library:CRYSTAL
U$15 = Jigyans Library:2X6HEADER
U$16-U$18 = Jigyans Library:1X6HEADER

## Board
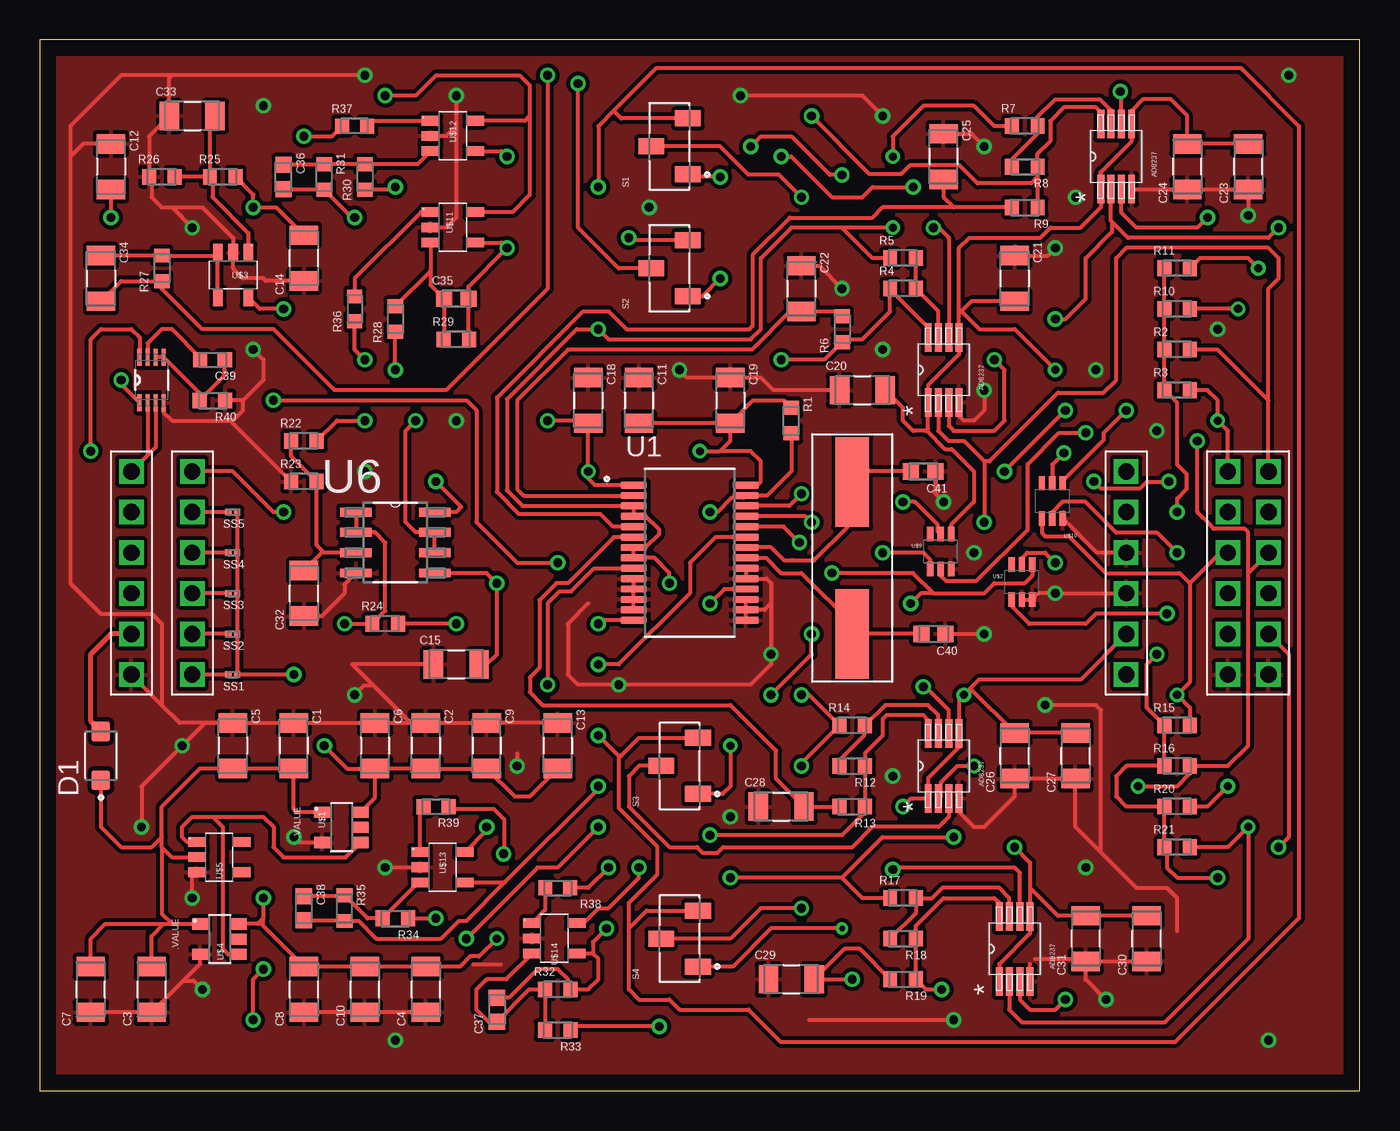
[diagram p9: board, top side]
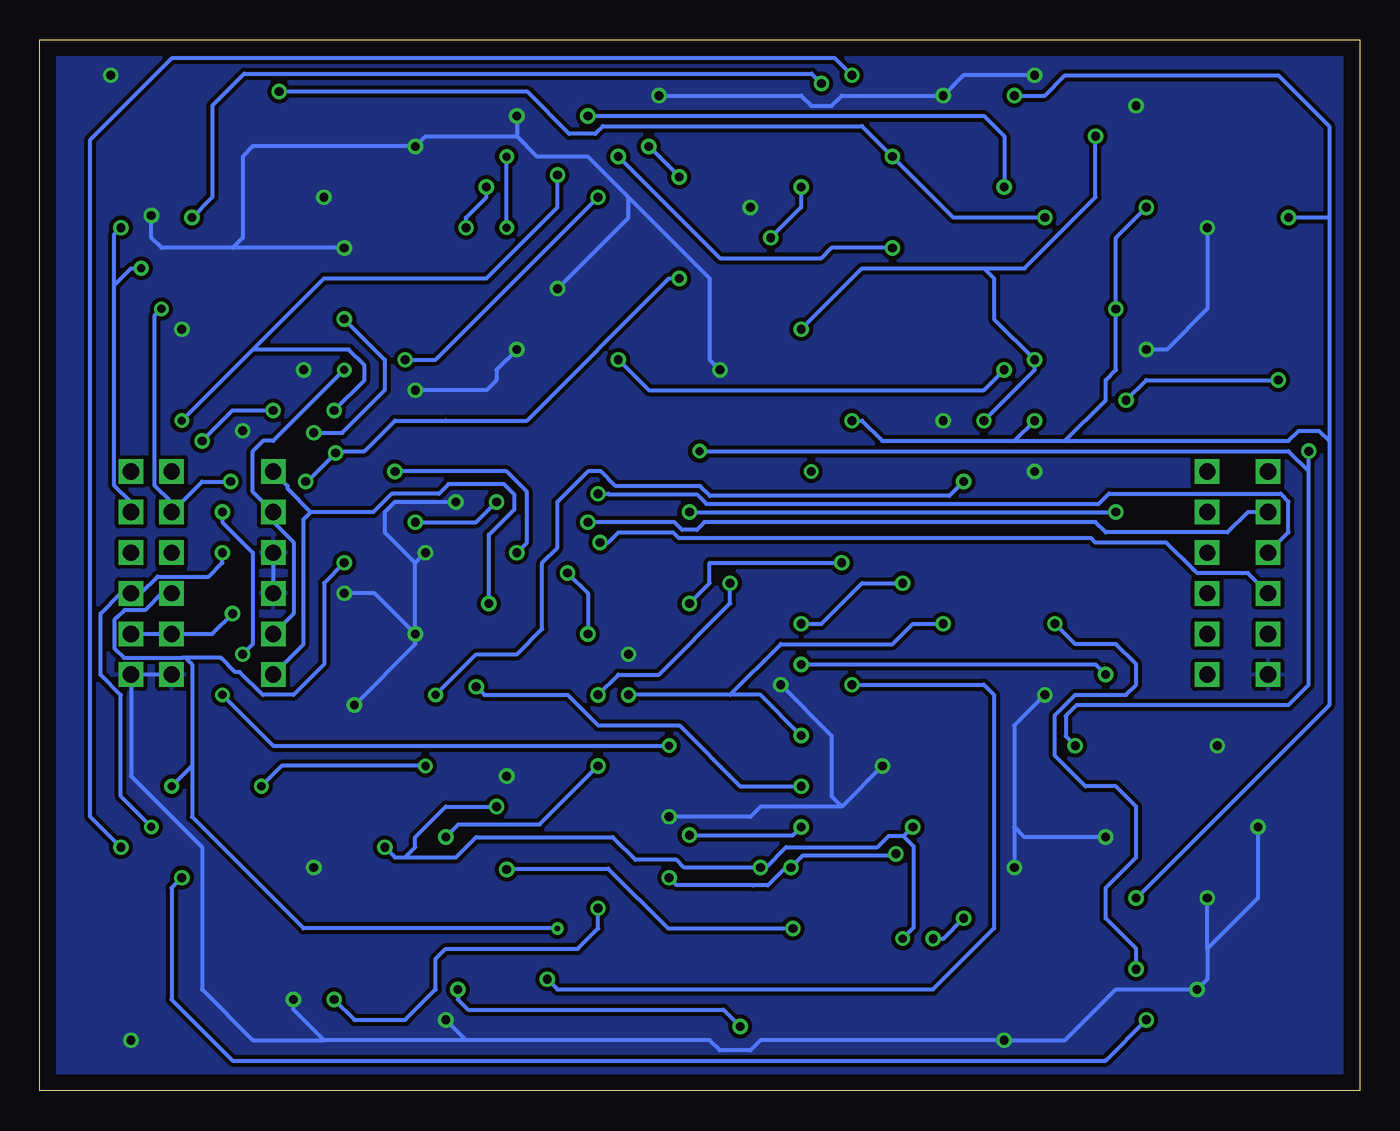
[diagram p10: board, bottom side, seen from below]

Size 82.53 x 65.71 mm. Coordinates in mm from the lower left corner, seen from the top.
Outline: 0,0 82.53,0 82.53,65.71 0,65.71 0,0
Copper layers (1*16): Top 0.035mm / dielectric 1.5mm / Bottom 0.035mm
Design rules "default *": minimum track width 6mil, minimum drill 0.35mm, track to track 10mil, track to pad 6mil, pad to pad 6mil, via to via 20mil, smd to smd 20mil, copper to edge 40mil, drill to drill 35mil, minimum pad ring 10mil, minimum via ring 8mil, stop-mask expansion 4mil, vias tented up to drill 0mil, thermal gap 10mil

### Footprints (pad centres in the part's own frame; a part is rotated, then mirrored left to right if it is on the bottom)
RM_8 = smd 1.778 x 0.432: 1 -2.032,0.965; 2 -2.032,0.33; 3 -2.032,-0.33; 4 -2.032,-0.965; 5 2.032,-0.965; 6 2.032,-0.33; 7 2.032,0.33; 8 2.032,0.965
CAPC3216X180N = smd 1.21 x 1.77: 1 -1.428,0; 2 1.428,0
CAPC1608X100N = smd 1 x 1.02: 1 -0.759,0; 2 0.759,0
CAPC1608X90N = smd 0.89 x 0.93: 1 -0.77,0; 2 0.77,0
SODFL3617X108N = smd 1.25 x 1.16: A 1.53,0; C -1.53,0
RESC1608X55N = smd 0.87 x 0.98: 1 -0.8,0; 2 0.8,0
RESC1608X55N' = smd 0.87 x 0.93: 1 -0.78,0; 2 0.78,0
SW_CJS-1200TA = smd 1 x 1.6: 1 -1.75,-1.15; 2 0,1.15; 3 1.75,-1.15
CAPC0603X33N = smd 0.38 x 0.4: 1 -0.281,0; 2 0.281,0
SOP65P780X200-28N = smd 1.651 x 0.432: 1 -3.505,4.225; 2 -3.505,3.575; 3 -3.505,2.925; 4 -3.505,2.275; 5 -3.505,1.625; 6 -3.505,0.975; 7 -3.505,0.325; 8 -3.505,-0.325; 9 -3.505,-0.975; 10 -3.505,-1.625; 11 -3.505,-2.275; 12 -3.505,-2.925; 13 -3.505,-3.575; 14 -3.505,-4.225; 15 3.505,-4.225; 16 3.505,-3.575; 17 3.505,-2.925; 18 3.505,-2.275; 19 3.505,-1.625; 20 3.505,-0.975; 21 3.505,-0.325; 22 3.505,0.325; 23 3.505,0.975; 24 3.505,1.625; 25 3.505,2.275; 26 3.505,2.925; 27 3.505,3.575; 28 3.505,4.225
SOP50P310X90-8N = smd 1.067 x 0.254: 1 -1.422,0.762; 2 -1.422,0.254; 3 -1.422,-0.254; 4 -1.422,-0.762; 5 1.422,-0.762; 6 1.422,-0.254; 7 1.422,0.254; 8 1.422,0.762
SOIC127P600X175-8N = smd 1.981 x 0.559: 1 -2.464,1.905; 2 -2.464,0.635; 3 -2.464,-0.635; 4 -2.464,-1.905; 5 2.464,-1.905; 6 2.464,-0.635; 7 2.464,0.635; 8 2.464,1.905
TSOP-5 = smd 0.7 x 1: 1 0.35,0.5; 2 2.25,0.5; 3 2.25,2.9; 4 1.3,2.9; 5 0.35,2.9
SC70-6 = smd 0.4 x 0.9: 1 0.435,-0.397; 2 1.085,-0.396; 3 1.735,-0.397; 4 1.735,1.804; 5 1.085,1.804; 6 0.435,1.804
SOT23-5 = smd 0.6 x 1.1: 1 0.3,-2.25; 2 1.25,-2.25; 3 2.2,-2.25; 4 2.2,0.55; 5 0.3,0.55
CRYSTAL = smd 5.6 x 2.1: 1 0,0; 2 9.5,0
PINHEADER2X6 = drill 1.02 pad 1.422 square: 1 0,0; 2 2.54,0; 3 5.08,0; 4 7.62,0; 5 10.16,0; 6 12.7,0; 7 12.7,2.54; 8 10.16,2.54; 9 7.62,2.54; 10 5.08,2.54; 11 2.54,2.54; 12 0,2.54
PINHEADER1X6 = drill 1.02 pad 1.422 square: 1 0,0; 2 2.54,0; 3 5.08,0; 4 7.62,0; 5 10.16,0; 6 12.7,0

### Placement (x,y rotation side)
AD1  67.31,58.42 90 top
AD2  56.52,20.32 90 top
AD3  60.96,8.89 90 top
AD8237  56.52,45.09 90 top
C1  15.88,21.59 270 top
C2  24.13,21.59 270 top
C3  6.98,6.35 90 top
C4  24.13,6.35 90 top
C5  12.06,21.59 270 top
C6  20.96,21.59 270 top
C7  3.17,6.35 90 top
C8  16.51,6.35 90 top
C9  27.94,21.59 270 top
C10  20.32,6.35 90 top
C11  37.46,43.18 270 top
C12  4.45,57.79 270 top
C13  32.38,21.59 270 top
C14  16.51,52.07 90 top
C15  26.04,26.67 0 top
C18  34.29,43.18 270 top
C19  43.18,43.18 270 top
C20  51.43,43.81 0 top
C21  60.96,50.8 270 top
C22  47.62,50.16 270 top
C23  75.57,57.79 90 top
C24  71.76,57.79 90 top
C25  56.52,58.42 270 top
C26  60.96,20.96 90 top
C27  64.77,20.96 90 top
C28  46.35,17.78 0 top
C29  46.99,6.99 0 top
C30  69.22,9.53 90 top
C31  65.41,9.53 90 top
C32  16.51,31.12 90 top
C33  9.53,60.96 0 top
C34  3.81,50.8 270 top
C35  26.04,49.53 0 top
C36  15.24,57.15 270 top
C37  28.58,5.08 90 top
C38  16.51,11.43 270 top
C39  10.79,45.72 180 top
C40  55.88,28.58 180 top
C41  55.24,38.73 180 top
D1  3.81,20.96 90 top
R1  46.99,41.91 270 top
R2  71.12,46.36 0 top
R3  71.12,43.81 0 top
R4  53.98,50.16 0 top
R5  53.98,52.07 0 top
R6  50.16,47.62 90 top
R7  61.59,60.33 0 top
R8  61.59,57.79 180 top
R9  61.59,55.25 180 top
R10  71.12,48.9 0 top
R11  71.12,51.44 0 top
R12  50.8,20.32 180 top
R13  50.8,17.78 180 top
R14  50.8,22.86 0 top
R15  71.12,22.86 0 top
R16  71.12,20.32 0 top
R17  53.98,12.06 0 top
R18  53.98,9.53 180 top
R19  53.98,6.99 180 top
R20  71.12,17.78 0 top
R21  71.12,15.24 0 top
R22  16.51,40.64 0 top
R23  16.51,38.1 0 top
R24  21.59,29.21 0 top
R25  11.43,57.15 0 top
R26  7.62,57.15 0 top
R27  7.62,51.44 90 top
R28  22.23,48.26 90 top
R29  26.04,46.99 0 top
R30  20.32,57.15 90 top
R31  17.78,57.15 270 top
R32  32.38,6.35 0 top
R33  32.38,3.81 180 top
R34  22.23,10.79 180 top
R35  19.05,11.43 270 top
R36  500k  [RESC1608X55N']  19.69,48.9 90 top
R37  500k  [RESC1608X55N']  19.69,60.33 0 top
R38  500k  [RESC1608X55N']  32.38,12.7 180 top
R39  500k  [RESC1608X55N']  24.77,17.78 180 top
R40  10.79,43.18 180 top
S1  39.37,59.05 90 top
S2  39.37,51.44 90 top
S3  40,20.32 90 top
S4  40,9.53 90 top
SS1  12.06,26.04 180 top
SS2  12.06,28.58 180 top
SS3  12.06,31.12 180 top
SS4  12.06,33.66 180 top
SS5  12.06,36.2 180 top
U1  40.64,33.66 0 top
U2  6.98,44.45 90 top
U6  22.23,34.29 0 top
U$1  17.15,17.78 270 top
U$2  60.32,31.12 0 top
U$3  13.33,50.16 180 top
U$4  9.53,10.79 270 top
U$5  12.06,15.88 270 top
U$8  50.8,28.58 90 top
U$9  55.24,33.02 0 top
U$10  62.23,36.2 0 top
U$11  26.67,55.25 270 top
U$12  26.67,60.96 270 top
U$13  26.04,15.24 270 top
U$14  33.02,10.79 270 top
U$15  74.3,38.73 270 top
U$16  67.95,26.04 90 top
U$17  5.71,26.04 90 top
U$18  9.53,26.04 90 top

### Tracks (layer width: path | path; a pad name or v marks a point on that pad's centre or on a via)
1_-IN  (via drill 0.55)
  Top 0.254: AD8237.3 56.84,41.58 57.15,41.27 59.69,41.27 60.32,41.91 60.32,45.09 v59.69,45.72 | S1.2 42.54,59.05 44.29,57.31 46.2,57.31 v47.62,55.88
  Bottom 0.254: v59.69,45.72 57.78,45.72 v47.62,55.88
1_IN+  (via drill 0.55)
  Top 0.254: 76.84,43.18 73.66,46.36 R2.2 | U$15.12 76.84,43.18 | 76.84,43.18 76.84,50.16 77.47,50.8 77.47,52.07 76.84,52.7 67.95,52.7 67.31,52.07 67.31,44.45 66.52,43.66 63.67,43.66 59.39,39.37 59.05,39.37 | AD8237.2 56.18,41.27 56.82,40.64 57.78,40.64 59.05,39.37 | 59.05,39.37 v59.05,35.56 | U$9.5 56.16,35 56.16,35.39 54.72,36.83 v53.98,36.83
  Bottom 0.254: v59.05,35.56 55.24,35.56 v53.98,36.83
1_IN-  (via drill 0.51, 0.55)
  Top 0.254: U$15.1 74.3,41.27 v73.66,41.91 73.66,43.18 73.03,43.81 R3.2 | v64.14,42.55 v60.32,38.73 | U$9.1 55.68,33.22 55.24,33.66 v52.7,33.66 | v50.16,57.27 49.41,57.27 46.99,59.69 45.09,59.69 v44.45,59.05 | v42.54,57.15 40.67,57.15 S1.1
  Bottom 0.254: v64.14,42.55 62.23,44.45 62.23,45.36 63.23,46.36 69.22,46.36 | v73.66,41.91 69.22,46.36 | v50.16,57.27 50.16,55.25 54.61,50.8 64.77,50.8 69.22,46.36 | v44.45,59.05 v42.54,57.15 | v52.7,33.66 52.07,34.29 52.07,37.47 53.34,38.73 v60.32,38.73
2_-IN  (via drill 0.55)
  Top 0.254: AD1.3 67.64,54.91 68.58,53.98 72.39,53.98 v73.03,54.61 | S2.2 36.2,51.44 33.66,53.98 v33.66,62.99
  Bottom 0.254: v73.03,54.61 71.76,55.88 71.76,61.59 69.75,63.61 34.27,63.61 v33.66,62.99
2_IN+  (via drill 0.51, 0.55)
  Top 0.254: 67.04,54.34 66.98,54.41 AD1.2 | 67.04,54.34 67.04,53.71 65.41,52.07 65.41,49.53 64.14,48.26 v63.5,48.26 | v77.47,53.98 76.84,53.34 68.05,53.34 67.04,54.34 | v65.41,41.15 63.74,41.15 61.77,39.19 61.77,35.11 58.56,31.89 56.66,31.89 56.33,32.23 U$9.2 | R11.2 72.56,52.07 75.57,52.07 v76.2,51.44
  Bottom 0.254: U$15.11 76.84,36.81 77.88,37.85 77.88,50.39 | 77.88,50.39 76.84,51.44 v76.2,51.44 | 77.88,50.39 77.88,53.57 v77.47,53.98 | v63.5,48.26 60.96,45.72 60.96,43.81 63.62,41.15 v65.41,41.15
2_IN-  (via drill 0.51, 0.55)
  Top 0.254: v74.93,48.9 R10.2 | v64.04,39.88 63.31,39.16 U$10.5 | v42.54,50.8 41.43,49.69 S2.1 | v70.61,38.1 69.23,38.1 68.83,37.69 66.33,37.69 v65.92,38.1
  Bottom 0.254: v74.93,48.9 75.34,48.49 75.34,37.85 74.3,36.81 U$15.2 72.39,38.1 v70.61,38.1 | v65.92,38.1 65.82,38.1 v64.04,39.88 63.92,40.01 62.23,40.01 60.32,41.91 57.15,41.91 52.07,41.91 43.18,50.8 v42.54,50.8
3_-IN
  Top 0.254: S3.2 37.46,20.32 36.83,19.69 36.83,17.78 39.37,15.24 41.09,15.24 41.45,14.88 42.37,14.88 42.73,15.24 50.8,15.24 52.07,16.51 56.21,16.51 56.84,17.14 AD2.3
3_IN+  (via drill 0.51, 0.55)
  Top 0.254: 75.57,32.38 U$15.10 | 75.57,32.38 75.57,21.59 74.3,20.32 R16.2 71.92,19.85 71.12,19.05 v68.68,19.05 | AD2.2 56.35,18.45 56.35,19.29 57.38,20.32 v58.42,20.32 | 75.57,32.38 75.57,34.93 75.34,35.15 73.41,35.15 73.25,35.31 73.25,35.33 72.39,36.2 v72.39,40.64 | v67.95,42.55 66.52,41.12 66.52,40.69 63.96,38.14 U$10.4
  Bottom 0.254: v58.42,20.32 67.41,20.32 v68.68,19.05 | v72.39,40.64 70.48,42.55 v67.95,42.55
3_IN-  (via drill 0.51)
  Top 0.254: v43.18,21.59 43.18,19.05 42.7,18.57 S3.1 | R15.2 71.92,23.96 v71.12,24.77 71.92,25.57 71.92,31.75 | 71.92,31.75 71.29,32.38 66.66,32.38 64.35,34.7 62.86,34.7 62.66,34.9 U$10.1 | 71.92,31.75 73.83,33.66 U$15.3
  Bottom 0.254: v71.12,24.77 67.95,21.59 v43.18,21.59
4_-IN  (via drill 0.55)
  Top 0.254: v47.62,11.43 45.09,11.43 43.18,9.53 S4.2 | v64.14,5.71 63.5,5.08 61.92,5.08 61.29,5.71 AD3.3
  Bottom 0.254: v64.14,5.71 62.86,4.45 59.69,4.45 57.78,6.35 57.78,8.25 57.15,8.89 48.89,8.89 47.62,10.16 v47.62,11.43
4_IN+  (via drill 0.51, 0.55)
  Top 0.254: R21.2 74.3,15.24 v75.57,16.51 75.57,9.53 70.32,4.28 61.43,4.28 60.63,5.08 AD3.2 | v71.12,33.66 69.85,34.93 67.29,34.93 65.39,36.83 63.95,36.83 63.31,36.2 U$10.2
  Bottom 0.254: v75.57,16.51 77.47,18.42 77.47,24.75 78.74,26.02 78.74,29.85 77.47,31.12 U$15.9 76.22,31.12 75.18,32.16 71.98,32.16 71.12,33.02 v71.12,33.66
4_IN-  (via drill 0.35, 0.51, 0.55)
  Top 0.254: v74.3,19.05 73.03,17.78 R20.2 | v50.16,10.16 45.72,10.16 43.34,7.78 S4.1 | v63.5,33.02 62.86,33.66 61.75,33.66 61.41,33.31 U$2.5
  Bottom 0.254: 73.03,20.32 73.03,26.67 73.25,26.9 73.25,26.92 73.41,27.08 | v74.3,19.05 73.03,20.32 | 73.03,20.32 73.03,17.14 66.04,10.16 v50.16,10.16 | U$15.4 74.91,31.12 75.95,30.07 77.24,30.07 77.7,29.62 77.72,29.62 77.88,29.46 77.88,27.69 77.27,27.08 73.66,27.08 73.41,27.08 | v63.5,33.02 64.77,31.75 64.77,26.67 66.68,24.77 68.6,24.77 70.03,26.19 70.31,26.19 71.2,27.08 73.41,27.08
D_G  (via drill 0.55)
  Top 0.254: v70.48,29.85 66.04,29.85 65.41,29.21 61.87,29.21 60.76,30.32 U$2.1 | C34.2 5.07,50.63 R27.1 7.62,50.16 10.16,47.62 14.61,47.62 18.42,43.81 25.4,43.81 31.75,50.16 v31.75,63.5 | U$15.8 78.11,27.3 78.11,15.88 v77.47,15.24
  Bottom 0.254: U$15.8 U$15.5 71.76,28.58 v70.48,29.85 | v31.75,63.5 32.82,64.57 74.3,64.57 79.38,59.49 79.38,17.14 v77.47,15.24
DRDY
  Top 0.254: 6.73,39.75 U$17.6 | U2.2 6.73,39.75 | U2.3 7.24,40.26 6.73,39.75
GND  (via drill 0.55)
  Top 0.254: C4.1 C10.1 C8.1 | C7.1 C3.1 8.97,6.91 | 8.97,6.91 10.03,7.96 U$4.2 | AD3.4 61.92,7.95 | 62.23,8.25 65.25,8.25 C31.1 | C31.1 C30.1 | 66.36,14.92 68.58,12.7 70.48,12.7 71.12,12.06 71.12,10 | 66.36,14.92 64.77,16.51 C27.1 C26.1 60.96,18.42 59.05,16.51 58.42,16.51 57.48,17.45 AD2.4 | U$2.2 U$2.3 62.46,31.12 v63.5,31.12 U$16.3 | U$16.4 66.11,33.66 U$10.3 | C40.1 v59.05,28.58 | 66.36,14.92 66.36,23.81 66.04,24.13 v62.86,24.13 | 8.97,6.91 9.6,6.91 v10.16,6.35 | v9.53,12.06 9.53,13.38 U$5.3 | C5.1 C1.1 C6.1 C2.1 | C2.1 C9.1 C13.1 | U$13.2 23.77,13.97 v21.59,13.97 | C5.1 10.32,23.02 v8.89,21.59 6.35,19.05 v6.35,16.51 | C5.1 8.73,23.02 7.62,24.13 | 7.62,24.13 U$17.1 | U1.15 U1.16 | U1.16 U1.17 | U1.20 U1.19 45.44,32.03 45.72,31.75 45.72,30.48 | 29.85,21.11 v29.85,20.32 | 48.1,4.45 v57.15,4.45 | v66.68,5.71 65.41,6.99 C31.1 | U1.13 U1.12 U1.11 U1.10 | v58.42,33.66 58.01,33.66 | AD1.4 68.31,56.36 C24.1 C23.1 v75.57,54.73 | 7.62,24.13 7.62,29.21 6.98,29.85 3.81,29.85 1.91,31.75 1.91,58.42 | 1.91,58.42 1.91,60.33 5.08,63.5 8.26,63.5 | C21.1 63.02,52.23 v63.5,52.7 | C25.1 58.26,59.85 v59.05,59.05 | C22.1 48.74,51.59 v50.16,50.16 | U$1.2 16.22,15.53 v15.88,15.88 | v20.32,63.5 8.26,63.5 | U$11.2 24.44,53.98 25.4,53.98 26.04,54.61 26.04,60.33 | v59.05,43.81 59.05,42.55 58.42,41.91 57.78,41.91 57.48,42.22 AD8237.4 | C41.1 56,37.34 v56.52,36.83 | 45.72,30.48 45.32,30.08 U1.16 | 45.72,30.48 v45.72,27.3 45.72,26.67 44.45,25.4 v36.2,25.4 33.66,25.4 33.02,26.04 33.02,29.21 34.29,30.48 | 52.55,46.36 v52.7,46.36 | v52.7,60.96 51.43,62.23 v43.81,62.23 | v26.04,62.23 26.04,60.33 | v40,45.09 40.48,44.61 C19.1 45.09,44.61 45.88,43.81 C20.1
  Top 0.254: 34.77,45.09 C18.1 | 8.26,55.25 7.62,55.25 6.98,55.88 6.98,56.98 R26.1 6.82,59.68 C33.1 8.1,63.34 8.26,63.5 | 8.26,55.25 10.16,55.25 12.08,53.32 U$3.2 12.08,51.41 12.7,50.8 13.97,50.8 14.13,50.64 C14.1 | C12.1 2.7,59.21 1.91,58.42 | 37.46,45.09 C11.1 | 8.26,55.25 v9.53,53.98 | v13.33,46.36 13.97,45.72 13.97,44.45 12.7,43.18 | U2.4 7.75,42.42 8.26,41.91 12.06,41.91 | C15.1 19.53,26.67 20.88,25.32 | 20.88,25.32 23.18,23.02 C2.1 | U6.4 19.05,31.67 19.05,31.12 17.62,29.69 C32.1 | R23.1 12.06,41.75 12.06,41.91 | 22.07,3.17 v22.23,3.17 | 20.88,25.32 20.24,25.32 v19.69,24.77 | U$12.2 25.42,59.71 26.04,60.33 | 28.83,7.9 27.11,7.9 | 12.06,41.91 12.7,42.55 12.7,43.18 | 12.7,43.18 R40.1
  Bottom 0.254: U$16.4 U$16.3 | U$15.6 U$15.7 76.84,19.69 72.39,15.24 72.39,6.35 69.22,3.17 64.77,3.17 | v59.05,28.58 61.59,31.12 v63.5,31.12 | v62.86,24.13 59.05,27.94 v59.05,28.58 | 9.53,8.89 9.53,6.99 v10.16,6.35 15.24,6.35 18.42,3.17 v22.23,3.17 37.46,3.17 38.1,2.54 40,2.54 40.64,3.17 55.88,3.17 | 9.53,8.89 v9.53,12.06 | v6.35,16.51 6.35,12.06 9.53,8.89 | v29.85,20.32 32.38,17.78 | v43.18,17.14 38.1,17.14 37.46,17.78 32.38,17.78 | v57.15,4.45 55.88,3.17 | 55.88,3.17 64.77,3.17 | 64.77,3.17 66.68,5.08 v66.68,5.71 | v59.05,28.58 59.05,33.02 | 59.05,33.02 v58.42,33.66 | v56.52,36.83 60.32,36.83 60.96,36.2 60.96,34.93 59.05,33.02 | v43.81,62.23 34.92,62.23 34.29,61.59 33.02,61.59 32.38,62.23 v26.04,62.23 24.77,63.5 v20.32,63.5 | v59.05,43.81 54.61,43.81 53.98,44.45 53.98,45.09 v52.7,46.36 | 52.7,59.69 58.42,59.69 v59.05,59.05 69.22,59.05 69.85,58.42 69.85,53.34 70.48,52.7 | 45.72,55.88 48.26,58.42 51.43,58.42 52.7,59.69 | 32.38,17.78 33.02,18.42 33.02,22.23 v36.2,25.4 | v63.5,52.7 70.48,52.7 | 70.48,52.7 74.93,52.7 75.57,53.34 v75.57,54.73 | 45.72,55.88 40.64,50.8 40.64,45.72 v40,45.09 | v50.16,50.16 45.72,54.61 45.72,55.88 | v52.7,60.96 52.7,59.69 | v9.53,53.98 9.53,48.9 12.06,46.36 v13.33,46.36 | 21.59,16.51 v21.59,13.97 | v19.69,24.77 21.59,22.86 21.59,16.51 | v15.88,15.88 20.96,15.88 21.59,16.51
  other vias: 65.41,13.97 26.04,41.91 20.32,38.73 38.1,55.25 66.04,45.09 64.77,55.88 73.66,47.62 78.11,63.5 76.84,3.17 13.97,61.59 53.34,19.69 69.85,41.27
  pour Top: -3.81,-3.17 -3.81,67.31 -1.91,69.22 86.36,69.22 86.36,-3.17
  pour Bottom: -5.08,71.12 87,71.12 87,-3.81 -5.08,-3.81
I_BIAS  (via drill 0.55)
  Top 0.254: U6.1 U6.2 20.96,34.93 21.59,34.29 21.59,30.01 R24.1 v19.05,29.21 | v73.66,13.33 71.12,13.33 70.48,13.97 70.48,15.07 R21.1 R20.1 67.95,17.78 67.31,18.42 67.31,19.69 67.95,20.32 R16.1 R15.1 69.22,23.96 69.22,26.67 v69.85,27.3 | v13.33,4.45 13.33,6.99 v13.97,7.62 | v71.12,36.2 71.12,37.04 71.72,37.64 71.72,38.56 71.12,39.16 71.12,43.02 R3.1 R2.1 R10.1 R11.1
  Bottom 0.254: v71.12,36.2 71.12,35.56 69.22,33.66 69.22,27.94 v69.85,27.3 | v73.66,13.33 74.3,12.7 74.3,5.71 70.48,1.91 15.88,1.91 v13.33,4.45 | v13.97,7.62 13.97,8.89 15.88,10.79 15.88,12.7 13.97,14.6 13.97,17.78 15.24,19.05 17.15,19.05 19.05,20.96 19.05,23.5 17.78,24.77 14.61,24.77 13.97,25.4 13.97,26.67 15.24,27.94 17.78,27.94 v19.05,29.21
MCP_DRDY  (via drill 0.55)
  Top 0.254: U1.18 42.81,31.38 v41.91,30.48 | v14.61,43.18 26.67,43.18 27.31,42.55 27.31,35.56 29.85,33.02 v32.38,33.02 | U2.1 5.08,44.17 v5.08,44.45
  Bottom 0.254: v41.91,30.48 40.64,31.75 40.64,33.02 v32.38,33.02 | v14.61,43.18 13.33,44.45 v5.08,44.45
MCP_RST  (via drill 0.55)
  Top 0.254: R1.2 46.99,38.73 45.48,37.23 U1.27 44,37.09 43.25,37.09 42.36,36.2 v41.91,36.2 | v15.24,36.2 14.61,36.2 12.06,38.73 U$18.6
  Bottom 0.254: v41.91,36.2 v15.24,36.2
MCP_SS  (via drill 0.55)
  Top 0.254: SS5.1 SS4.1 SS3.1 SS2.1 SS1.1 v15.88,26.04 | U1.23 42.25,34.63 40.64,33.02 40.64,31.12 36.2,26.67 v34.92,26.67
  Bottom 0.254: v34.92,26.67 16.51,26.67 v15.88,26.04
MISO  (via drill 0.55)
  Top 0.254: v48.26,35.56 47.89,35.93 U1.25
  Bottom 0.254: U$17.5 6.98,36.2 8.26,34.93 15.88,34.93 16.51,35.56 40.97,35.56 41.45,35.08 42.37,35.08 42.85,35.56 v48.26,35.56
MOSI  (via drill 0.55)
  Top 0.254: v47.62,37.34 46.86,36.58 U1.26
  Bottom 0.254: U$17.4 4.45,34.93 4.45,36.85 4.94,37.34 15.67,37.34 16.31,36.7 40.84,36.7 41.45,37.31 46.96,37.31 46.99,37.34 v47.62,37.34
N$1
  Top 0.254: U1.22 45.72,33.98 46.52,33.18 47.04,33.18 48.42,33.18 50.49,35.26 50.49,37.77 U$8.2 51.46,38.73 C41.2
N$3
  Top 0.254: C40.2 U$8.1 50.8,29.21 47.62,32.38 46.35,32.38 45.41,33.33 U1.21
N$4
  Top 0.254: SS2.2 U$18.2
N$5  (via drill 0.55)
  Top 0.254: R19.2 51.27,8.89 50.32,8.89 C29.2 v50.8,6.99 | v31.75,25.4 31.75,30.48 32.51,31.24 33.02,31.24 33.23,31.24 34.67,32.68 U1.9
  Bottom 0.254: v50.8,6.99 50.16,6.35 26.67,6.35 22.86,10.16 22.86,24.77 23.5,25.4 v31.75,25.4
N$6
  Top 0.254: AD8237.7 56.18,48.76 R4.2 R5.2
N$7
  Top 0.254: AD2.7 56.18,23.5 55.55,24.13 52.87,24.13 R14.2 51.55,22.79 51.55,22.24 50,20.68 R12.2
N$8
  Top 0.254: R6.2 49.85,48.74 C22.2 46.91,48.74 44.53,46.36 33.02,46.36 29.85,43.18 29.85,37.63 30.25,37.23 U1.2
N$9
  Top 0.254: AD1.7 66.98,61.32 66.3,62 63.5,62 62.39,60.9 R7.2 62.39,59.86 60.79,58.26 R8.2
N$10
  Top 0.254: R9.2 57.15,55.25 | 57.15,55.25 52.7,55.25 52.07,54.61 46.91,54.61 44.58,52.28 44.58,47.84 44.37,47.62 36.67,47.62 35.56,48.74 33.97,48.74 28.58,43.35 28.58,37.47 29.97,36.07 35.05,36.07 35.84,35.28 U1.5 | C25.2 56.52,55.88 57.15,55.25
N$11
  Top 0.254: R13.2 C28.2 46.04,19.53 46.04,21.27 43.18,24.13 31.45,24.13 30.64,24.94 30.64,25.86 31.24,26.47 31.24,30.69 32.3,31.75 32.38,31.75 33.02,31.75 35.9,34.63 U1.6
N$12
  Top 0.254: AD3.7 60.63,12.06 59.99,12.7 56.43,12.7 55.8,12.06 R17.2 54.77,11.12 R18.2
N$13
  Top 0.254: U6.3 17.78,33.66 | 17.78,33.66 17.62,33.66 C32.2 | 17.78,33.66 17.31,34.12 R23.2 15.71,39.7 R22.1
N$14
  Top 0.254: R25.1 10.63,60.64 C33.2 | R25.1 10.79,56.98 10.79,55.88 13.04,53.64 U$3.1 | R25.1 R26.2
N$15
  Top 0.254: C34.1 7.61,52.23 R27.2 10.96,52.23 11.11,52.39 | 11.11,52.39 U$3.3 | U$3.4 11.11,49.64 11.11,52.39
N$16
  Top 0.254: C38.1 19.01,12.19 R35.1 20.49,10.79 R34.2 23.67,13.04 U$13.3
N$17
  Top 0.254: SS1.2 U$18.1
N$18
  Top 0.254: R33.2 R32.1 30.6,6.35 C37.1 28.06,4.32 27.31,5.08 27.31,6.35 27.94,6.99 29.16,6.99 U$14.3
N$19
  Top 0.254: SS3.2 U$18.3
N$20
  Top 0.254: U$11.1 23.83,54.95 19.69,50.8 R36.2
N$21
  Top 0.254: U2.6 U2.5 9.99,43.62 R40.2 11.56,44.75 C39.1
N$22
  Top 0.254: U2.7 6.73,46.74 7.62,47.62 8.26,47.62 10.03,45.86 C39.2
N$23
  Top 0.254: U$13.1 23.79,17.58 R39.2
N$24
  Top 0.254: SS4.2 U$18.4
N$25
  Top 0.254: R38.2 31.61,11.33 U$14.1
N$26
  Top 0.254: U$12.3 23.61,57.95 R30.2 R31.1 17.74,57.91 C36.1
N$27
  Top 0.254: R37.2 20.8,60.66 U$12.1
N$28
  Top 0.254: SS5.2 U$18.5
N$31
  Top 0.254: U$11.3 24.42,51.26 | 24.42,51.26 R28.2 | 24.42,51.26 24.42,50.39 C35.1 25.28,47.03 R29.1
OUT_1  (via drill 0.55)
  Top 0.254: AD8237.8 55.55,47.75 53.17,50.13 R4.1 53.17,48.73 51.43,46.99 50.33,46.99 R6.1 49.06,45.72 v46.35,45.72 | v22.23,45.09 R28.1
  Bottom 0.254: v46.35,45.72 44.45,43.81 23.5,43.81 v22.23,45.09
OUT_2  (via drill 0.55)
  Top 0.254: 62.39,57.15 R8.1 62.39,58.59 63.18,59.37 63.18,60.64 64.03,61.49 66.04,61.49 66.34,61.19 AD1.8 | 62.39,57.15 R9.1 | 62.39,57.15 61.99,56.75 58.64,56.75 57.52,57.88 54.4,57.88 53.85,57.33 51.89,57.33 v48.26,60.96 | v22.23,56.52 22.06,56.35 R30.1
  Bottom 0.254: v48.26,60.96 23.5,60.96 22.23,59.69 v22.23,56.52
OUT_3  (via drill 0.55)
  Top 0.254: AD2.8 55.55,23.19 55.24,23.5 52.95,23.5 52.7,23.25 52.7,22.23 51.6,21.12 R12.1 R13.1 51.6,17.43 50.16,16 v41.91,16 | v26.67,9.53 31.12,13.97 32.38,13.97 v34.92,16.51 | R34.1 v24.77,10.79
  Bottom 0.254: v41.91,16 35.44,16 v34.92,16.51 | v26.67,9.53 26.04,9.53 v24.77,10.79
OUT_4  (via drill 0.55)
  Top 0.254: AD3.8 59.99,11.76 59.69,12.06 56.52,12.06 54.77,10.32 R18.1 R19.1 55.41,6.35 v56.39,6.35 | v38.73,4.03 33.41,4.03 R33.1
  Bottom 0.254: v56.39,6.35 56.39,5.71 55.76,5.08 39.78,5.08 v38.73,4.03
REF  (via drill 0.55)
  Top 0.254: S3.3 37.46,22.07 36.35,20.96 | v34.92,56.52 34.92,60.33 35.88,61.28 | v36.83,53.34 36.98,53.19 S2.3 | 36.83,10.16 36.83,6.35 37.46,5.71 39.37,5.71 40,5.08 44.32,5.08 46.35,3.05 70.99,3.05 78.74,10.79 78.74,60.33 75.13,63.93 38.53,63.93 35.88,61.28 | 36.83,10.16 37.95,11.27 S4.3 | v45.72,24.77 48.26,27.3 v48.26,28.58 | 36.2,20.96 v34.92,22.23 | 36.35,20.96 36.2,20.96 | 36.2,20.96 36.2,20.8 | 36.2,20.8 36.35,20.96 | U$2.4 62.06,32.21 61.59,31.75 59.69,31.75 59.05,31.12 55.88,31.12 | 55.88,31.12 54.61,32.38 v49.53,32.38 | S1.3 36.35,60.8 35.88,61.28 | v26.04,29.21 R24.2 | 55.88,31.12 55.09,31.12 v54.45,30.48 | 36.83,10.16 36.83,11.76 38.58,13.51 38.58,15.31 36.2,17.7 36.2,20.8
  Bottom 0.254: v34.92,56.52 34.92,55.25 v36.83,53.34 | v34.92,22.23 37.46,24.77 39.37,24.77 | 39.37,24.77 v45.72,24.77 | v48.26,28.58 48.26,31.12 v49.53,32.38 | 39.37,24.77 36.2,27.94 29.21,27.94 27.94,29.21 v26.04,29.21 | U$16.6 67.03,37.82 67.03,37.64 65.59,36.2 | 65.59,36.2 66.04,35.74 66.04,27.94 U$16.1 | v54.45,30.48 54.45,34.78 52.86,36.37 52.86,37.29 53.51,37.94 56.98,37.94 57.58,37.34 60.53,37.34 61.68,36.2 65.59,36.2
REF+_OUT  (via drill 0.55)
  Top 0.254: U1.14 35.14,29.43 v34.92,29.21 | U6.5 27.94,32.38 v28.58,31.75 28.58,27.3 27.94,26.67 C15.2
  Bottom 0.254: v34.92,29.21 33.66,29.21 31.12,31.75 v28.58,31.75
REF_1  (via drill 0.55)
  Top 0.254: AD8237.6 56.84,53.34 56.21,53.98 v55.88,53.98 | v54.61,56.52 52.07,56.52 51.43,55.88 49.53,55.88 46.99,58.42 v46.35,58.42 | U$11.4 28.87,53.05 v29.21,52.7 26.79,50.29 C35.2 26.79,47.03 R29.2
  Bottom 0.254: v54.61,56.52 54.61,55.88 55.88,54.61 v55.88,53.98 | v29.21,52.7 33.02,52.7 33.66,52.07 40,52.07 v46.35,58.42
REF_2  (via drill 0.55)
  Top 0.254: AD1.6 67.64,62.42 v67.57,62.49 | C36.2 17.74,56.39 R31.2 19.52,54.61 v19.69,54.61 | v29.21,58.42 28.87,58.76 U$12.4
  Bottom 0.254: v19.69,54.61 25.4,54.61 v29.21,58.42 31.12,60.33 47.32,60.33 47.8,59.85 49.42,59.85 52.07,62.49 v67.57,62.49
REF_3  (via drill 0.55)
  Top 0.254: v55.24,25.28 55.37,25.28 56.84,23.8 AD2.6 | C38.2 16.55,10.63 R35.2 19.93,10.63 21.04,9.53 25.1,9.53 26.21,10.64 26.67,10.64 29.07,13.04 | U$13.4 29.07,13.04 | v34.92,19.05 34.92,18.89 29.07,13.04
  Bottom 0.254: v55.24,25.28 54.73,24.77 49.53,24.77 47.62,22.86 42.54,22.86 38.73,19.05 v34.92,19.05
REF_4  (via drill 0.55)
  Top 0.254: 34.59,8.6 34.92,8.25 34.92,6.99 34.29,6.35 R32.2 33.02,6.52 33.02,6.99 32.38,7.62 31.12,7.62 29.33,5.84 C37.2 | 34.59,8.6 U$14.4 | AD3.6 61.29,13.64 60.96,13.97 53.46,13.97 v53.34,13.85 | v35.44,10.16 34.59,9.31 34.59,8.6
  Bottom 0.254: v53.34,13.85 53.28,13.91 46.99,13.91 43.24,10.16 v35.44,10.16
SCL  (via drill 0.55)
  Top 0.254: v47.5,34.29 46.51,35.28 U1.24
  Bottom 0.254: U$17.3 6.98,32.38 10.16,32.38 10.39,32.61 10.41,32.61 12.08,34.29 16.51,34.29 16.79,34.57 42.58,34.57 42.93,34.93 46.35,34.93 46.99,34.29 v47.5,34.29
V_ENABLE
  Top 0.254: U$5.1 9.19,15.57 8.89,15.88 8.89,16.51 9.53,17.14 10.79,17.14 | 10.79,17.14 11.43,16.51 11.43,8.89 11.78,8.54 U$4.3 | 10.79,17.14 13.97,17.14 14.61,16.51 14.61,15.24 15.24,14.6 19.12,14.6 U$1.3
V_IN
  Top 0.254: 7.75,10.44 8.26,10.44 | 7.75,10.44 6.98,9.68 C3.2 | U$1.1 16.07,17.43 15.88,17.62 C1.2 C5.2 10,20.16 7.62,17.78 7.62,15.88 | 7.62,15.24 7.62,15.88 | D1.C 3.81,16.51 5.08,15.24 6.98,15.24 7.62,15.88 | C7.2 3.17,9.53 4.09,10.44 7.75,10.44 | 7.62,15.24 8.23,14.62 U$5.2 | 7.62,15.24 7.62,11.08 8.26,10.44 | 8.26,10.44 U$4.1
V_REF  (via drill 0.51, 0.55)
  Top 0.254: R5.1 52.07,52.07 50.16,53.98 | R17.1 51.43,12.06 50.16,13.33 | 50.16,13.33 v43.18,13.33 | v35.56,13.97 34.29,12.7 R38.1 | 50.16,13.33 52.7,15.88 v57.15,15.88 | v47.62,20.32 47.62,20.48 R14.1 48.09,24.77 v47.62,24.77 | R7.1 59.69,60.33 58.42,61.59 55.24,61.59 53.34,59.69 v53.34,58.42 | v53.34,53.98 50.16,53.98 | v16.51,59.69 18.27,59.69 R37.1 | v20.32,45.72 19.69,46.36 R36.1 | v23.5,41.91 22.86,41.27 22.86,35.56 23.5,34.93 U6.7 U6.6 | R39.1 25.7,17.62 28.4,17.62 29.05,16.97 29.05,14.88 v28.99,14.82 | v39.37,31.75 39.37,32.38 38.42,33.33 U1.8 U1.7 37.88,33.98 38.73,34.83 38.73,35.08 37.88,35.93 U1.4 U1.3 30.18,36.58 29.21,37.55 29.21,43.26 33.57,47.62 v34.92,47.62 35.56,46.99 44.45,46.99 45.09,47.62 45.09,52.07 46.99,53.98 50.16,53.98
  Bottom 0.254: v47.62,24.77 46.35,26.04 43.81,26.04 39.37,30.48 v39.37,31.75 | v53.34,53.98 v53.34,58.42 | v34.92,47.62 31.12,51.44 23.5,51.44 | 23.5,51.44 20.96,51.44 16.51,55.88 v16.51,59.69 | 23.5,51.44 22.86,50.8 22.86,48.26 v20.32,45.72 20.32,45.09 v23.5,41.91 | v28.99,14.82 29.08,14.73 34.8,14.73 v35.56,13.97 35.89,13.97 37,12.86 37.93,12.86 37.93,12.87 42.71,12.87 v43.18,13.33 | v57.15,15.88 56.36,16.67 51.28,16.67 v47.62,20.32
VAA  (via drill 0.51, 0.55)
  Top 0.254: 13.97,10.32 C8.2 C10.2 C4.2 26.27,7.78 26.9,8.41 27.46,8.41 v28.58,9.53 | 13.97,10.32 13.84,10.44 | 13.84,10.44 13.62,10.44 | 13.62,10.44 U$4.5 | U1.1 34.7,37.88 34.29,38.3 v34.29,38.73 C18.2 34.13,41.91 v31.75,41.91 | C20.2 53.98,42.7 53.98,41.91 54.61,41.27 55.4,41.27 | 55.4,41.27 55.55,41.42 AD8237.1 55.55,44.12 57.48,46.05 AD8237.5 57.48,48.59 | 57.63,48.74 57.48,48.59 | 57.48,48.59 57.48,48.9 | C23.2 C24.2 71.76,60.96 70.69,62.03 69.01,62.03 68.28,61.29 AD1.5 68.28,59.38 66.34,57.45 AD1.1 66.34,55.25 65.08,53.98 63.2,53.98 62.56,53.34 58.11,53.34 57.48,52.7 57.48,48.9 | 57.48,48.9 57.63,48.74 | 57.63,48.74 58.75,47.62 60.96,47.62 v63.5,45.09 | 58.1,25.08 v57.78,24.77 57.48,24.46 AD2.5 57.48,21.49 55.55,19.56 AD2.1 54.48,18.29 v53.98,17.78 | 58.1,25.08 58.74,25.72 65.09,25.72 U$16.2 | C27.2 C26.2 58.26,25.08 58.1,25.08 | v60.96,15.24 61.92,14.27 61.92,12.7 | 61.92,12.7 AD3.5 61.92,9.86 59.99,7.92 AD3.1 | C30.2 C31.2 63.67,10.95 61.92,12.7 | U$12.5 30.33,60.66 30.63,60.96 | U$9.4 56.98,35.39 58.42,36.83 58.42,38.73 57.02,40.13 56.61,40.13 55.47,41.27 55.4,41.27 | U$14.5 33.99,10.49 34.92,11.43 35.56,11.43 37.46,13.33 v37.46,13.97 | v13.97,12.06 13.97,10.79 | 13.97,10.32 13.97,10.79 | 13.84,10.67 13.62,10.44 | 13.97,10.79 13.84,10.67 | 13.84,10.67 13.84,10.44 | C21.2 58.26,49.37 57.63,48.74 | v21.59,62.23 23.5,62.23 24.77,63.5 30,63.5 30.63,62.87 30.63,60.96 | U$11.5 29.55,54.95 30.63,56.03 30.63,60.96 | v15.24,48.9 13.75,48.9 U$3.5 | R25.2 13.33,56.05 v13.33,55.25 14.76,55.25 C14.2 | v4.45,54.61 C12.2 | v24.77,38.1 26.35,36.51 26.04,36.2 U6.8 | R22.2 18.58,41.91 v20.32,41.91
  Top 0.254: U$13.5 27.94,16.3 v27.94,16.51
  Bottom 0.254: U$16.2 66.68,29.85 66.68,34.31 67.95,35.58 U$16.5 69.22,37.47 69.22,40.01 68.58,40.64 67.95,40.64 v63.5,45.09 | v31.75,41.91 31.12,41.91 29.85,40.64 21.59,40.64 | 1.91,40.64 1.91,24.13 v13.97,12.06 | v21.59,62.23 19.69,62.23 18.42,63.5 5.08,63.5 1.91,60.33 1.91,54.61 | 1.91,54.61 1.91,40.64 | v13.33,55.25 15.24,53.34 v15.24,48.9 15.24,45.09 15.88,44.45 15.88,43.18 18.42,40.64 | 1.91,54.61 v4.45,54.61 | 1.91,40.64 2.54,41.27 3.81,41.27 4.45,40.64 18.42,40.64 | 21.59,40.64 18.42,40.64 | v20.32,41.91 21.59,40.64 | v60.96,15.24 60.32,14.6 59.69,14.6 | 59.69,14.6 56.52,14.6 55.24,15.88 46.71,15.88 45.28,14.45 42.72,14.45 42.24,13.97 v37.46,13.97 37.13,13.97 35.86,15.24 30.15,15.24 29.45,15.94 28.53,15.94 | 59.69,14.6 59.05,15.24 59.05,15.88 57.15,17.78 v53.98,17.78 | v57.78,24.77 55.24,27.3 52.7,27.3 51.12,28.89 51.12,33.02 50.16,33.97 50.16,36.83 48.26,38.73 47.44,38.73 46.52,37.82 41.24,37.82 40.63,37.21 25.65,37.21 v24.77,38.1 | 28.53,15.94 27.88,15.28 27.88,10.22 v28.58,9.53 | 28.53,15.94 27.96,16.51 v27.94,16.51
VCC
  Top 0.305: U$17.2 4.45,28.58 3.17,27.3 3.17,23.12 D1.A
VDD  (via drill 0.51, 0.55)
  Top 0.254: U$1.5 20.96,18.34 C6.2 | C6.2 C2.2 C9.2 29.69,18.42 30.64,18.42 C13.2 | v41.27,40.01 42.54,40.01 | C19.2 43.18,40.64 42.54,40.01 | C19.2 44.61,43.18 46.52,43.18 R1.1 | U1.28 44.86,37.88 45.09,38.1 45.09,39.37 44.45,40.01 42.54,40.01 | v17.78,21.59 19.21,20.16 C6.2 | C19.2 C11.2 | v3.17,40.01 3.17,46.99 3.81,47.62 5.71,47.62 6.22,47.12 U2.8
  Bottom 0.254: v41.27,40.01 4.45,40.01 3.17,38.73 | 3.17,38.73 3.17,25.4 4.45,24.13 17.7,24.13 18.37,23.45 18.37,22.18 v17.78,21.59 | 3.17,38.73 v3.17,40.01